# EAGLE design pc_healthypi_move_nRF5340_v4 (EAGLE 9.6.2)

## Sheet 1 of 2
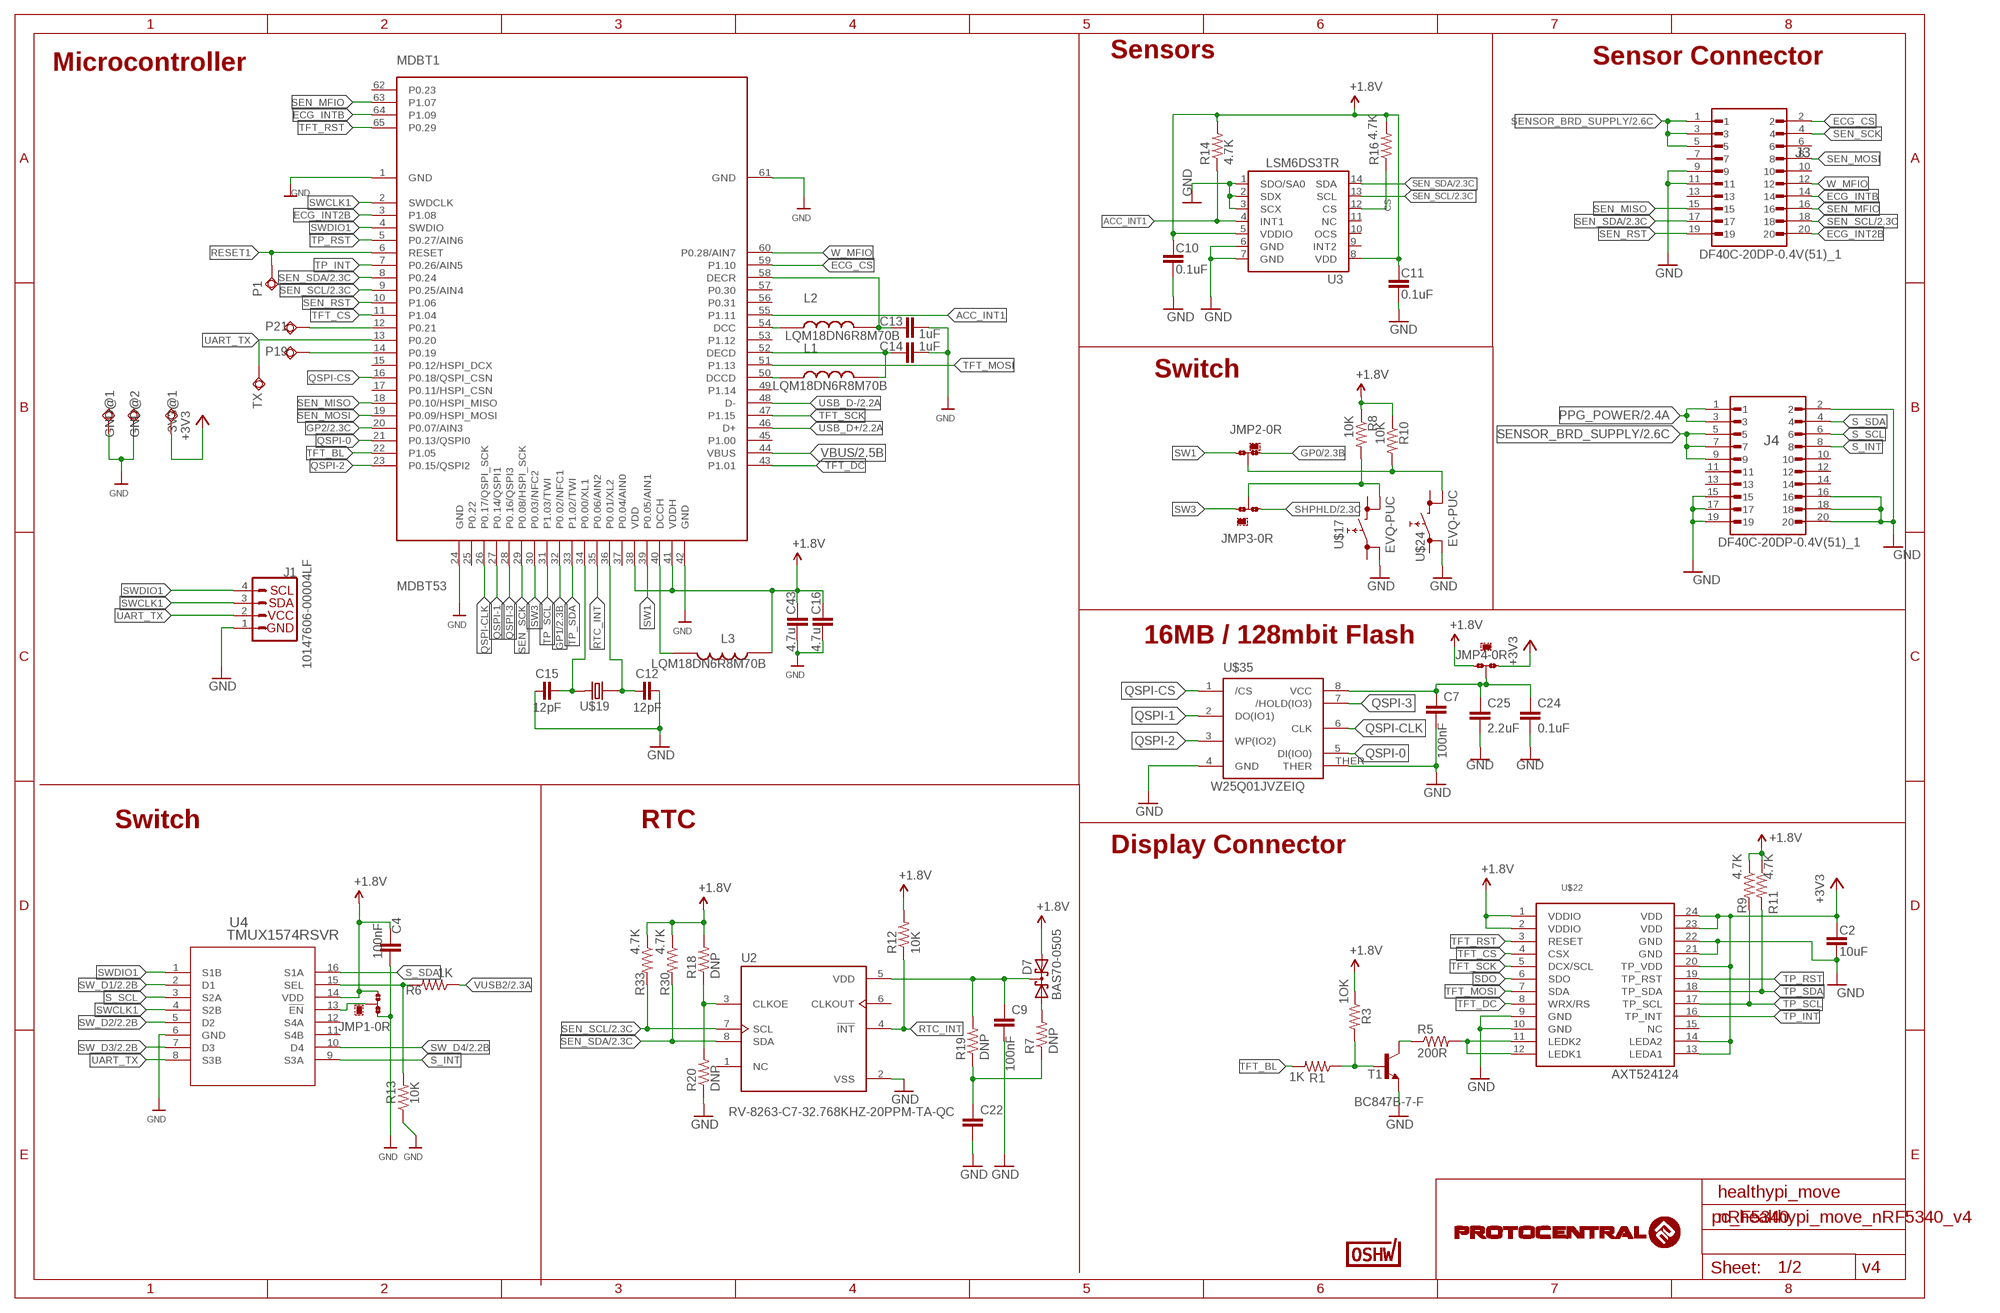
[diagram p0: schematic, sheet 1]

### Parts
3V3@1  TPSQTP13SQ  [TP13SQ]
C2  10uF  0.1UF-0603-100V-10%  [0603@1]
C4  100nF  2.2UF-0402_TIGHT-10V-10%-X5R  [0402-TIGHT]
C7  100nF  C-EUC0402  [C0402]
C9  100nF  C-EUC0402  [C0402]
C10  0.1uF  0.1UF-0402T-6.3V-10%-X7R  [0402-TIGHT]
C11  0.1uF  0.1UF-0402T-6.3V-10%-X7R  [0402-TIGHT]
C12  12pF  CAPACITORS-0402  [C0402]
C13  1uF  2.2UF-0402_TIGHT-10V-10%-X5R  [0402-TIGHT]
C14  1uF  2.2UF-0402_TIGHT-10V-10%-X5R  [0402-TIGHT]
C15  12pF  CAPACITORS-0402  [C0402]
C16  4.7u  C-EUC0402  [C0402]
C22  C-EUC1210  [C1210]
C24  0.1uF  0.1UF-0402T-6.3V-10%-X7R  [0402-TIGHT]
C25  2.2uF  2.2UF-0402_TIGHT-10V-10%-X5R  [0402-TIGHT]
C43  4.7u  C-EUC0402  [C0402]
D7  BAS70-0505  [SOT23]
GND@1  TPSQTP13SQ  [TP13SQ]
GND@2  TPSQTP13SQ  [TP13SQ]
J1  10147606-00004LF  QWIIC_CONNECTORJS-1MM  [JST04_1MM_RA]
J3  DF40C-20DP-0.4V(51)_1  [HRS_DF40C-20DP-0.4V(51)]
J4  DF40C-20DP-0.4V(51)_1  [HRS_DF40C-20DP-0.4V(51)]
JMP1  0R-JUMPB  [B0R-JMP]
JMP2  0R-JUMPB  [B0R-JMP]
JMP3  0R-JUMPB  [B0R-JMP]
JMP4  0R-JUMPB  [B0R-JMP]
L1  LQM18DN6R8M70B  [INDC1608X95N]
L2  LQM18DN6R8M70B  [INDC1608X95N]
L3  LQM18DN6R8M70B  [INDC1608X95N]
MDBT1  MDBT53  [MDBT53]
P1  TPSQTP13SQ  [TP13SQ]
P19  TPSQTP13SQ  [TP13SQ]
P21  TPSQTP13SQ  [TP13SQ]
R1  200  R-US_R0402  [R0402]
R3  200  R-US_R0402  [R0402]
R5  200R  R-US_R0402  [R0402]
R6  1K  RESISTOR0402-RES  [0402-RES]
R7  DNP  R-US_R0402  [R0402]
R8  10K  R-US_R0402  [R0402]
R9  4.7K  R-US_R0402  [R0402]
R10  10K  R-US_R0402  [R0402]
R11  4.7K  R-US_R0402  [R0402]
R12  10K  R-US_R0402  [R0402]
R13  10K  R-US_R0402  [R0402]
R14  4.7K  R-US_R0402  [R0402]
R16  4.7K  R-US_R0402  [R0402]
R18  DNP  R-US_R0402  [R0402]
R19  DNP  R-US_R0402  [R0402]
R20  DNP  R-US_R0402  [R0402]
R30  4.7K  R-US_R0402  [R0402]
R33  4.7K  R-US_R0402  [R0402]
T1  BC847B-7-F  MMBT2222ALT1-NPN-SOT23-BEC  [SOT23-BEC]
TX  TPSQTP13SQ  [TP13SQ]
U2  RV-8263-C7-32.768KHZ-20PPM-TA-QC  [IC_RV-8263-C7-32.768KHZ-20PPM-TA-QC]
U3  LSM6DS3TR  LSM6DS3  [LGA14L]
U4  TMUX1574RSVR  [RSV16_TEX]
U$1  CERT-SMALL  [CERT-SMALL-SILK]
U$17  EVQ-PUC  [EVQ-PUC]
U$19  520-327-12.5-34B(32.768KHZ)  ECS-X-34B  [ECX-31B]
U$22  AXT524124  [AXT524124]
U$24  EVQ-PUC  [EVQ-PUC]
U$35  W25Q01JVZEIQ  W25N01GVZEIG  [WSON-08]

### Nets
+1.8V: C4.1 C10.1 C11.1 C16.1 C43.1 D7.2(A2) JMP1.3 JMP4.3 L3.1 MDBT1.38(VDD) MDBT1.41(VDDH) R3.1 R8.1 R9.1 R10.1 R11.1 R12.2 R14.2 R16.2 R18.2 R30.1 R33.1 U3.5(VDDIO) U3.8(VDD) U4.14(VDD) U$22.1(VDDIO) U$22.2(VDDIO) ; also sheet 2
+3V3: 3V3@1.TP C2.1 JMP4.1 U$22.13(LEDA1) U$22.14(LEDA2) U$22.20(TP_VDD) U$22.23(VDD) U$22.24(VDD) ; also sheet 2
ACC_INT1: MDBT1.55(P1.11) R14.1 U3.4(INT1)
CS: R16.1 U3.12(CS)
ECG_CS: J3.2 MDBT1.59(P1.10)
ECG_INT2B: J3.20 MDBT1.3(P1.08)
ECG_INTB: J3.14 MDBT1.64(P1.09)
GND: C2.2 C4.2 C7.2 C9.2 C10.2 C11.2 C12.2 C13.2 C14.2 C15.1 C16.2 C22.2 C24.2 C25.2 C43.2 GND@1.TP GND@2.TP J1.1 J3.9 J3.11 J4.2 J4.15 J4.16 J4.17 J4.18 J4.19 J4.20 JMP1.1 MDBT1.1(GND) MDBT1.24(GND) MDBT1.42(GND) MDBT1.61(GND) R13.1 R20.1 T1.E U2.2(VSS) U3.1(SDO/SA0) U3.2(SDX) U3.3(SCX) U3.6(GND) U3.7(GND) U4.6(GND) U$17.3 U$22.9(GND) U$22.10(GND) U$22.21(GND) U$22.22(GND) U$24.3 U$35.4(GND) U$35.THER ; also sheet 2
GP0: JMP2.1 ; also sheet 2
GP1: MDBT1.32(P0.02/NFC1) ; also sheet 2
GP2: MDBT1.20(P0.07/AIN3) ; also sheet 2
N$5: MDBT1.12(P0.21) P21.TP
N$18: R5.2 U$22.11(LEDK2) U$22.12(LEDK1)
N$21: R5.1 T1.C
N$23: R1.1 R3.2 T1.B
N$26: R6.2 R13.2 U4.15(SEL)
N$28: C15.2 MDBT1.34(P0.00/XL1) U$19.P$2
N$30: C9.1 D7.3(K1K2) R19.2 U2.5(VDD)
N$31: R18.1 R20.2 U2.3(CLKOE)
N$32: D7.1(A1) R7.2
N$33: C22.1 R7.1 R19.1
N$34: C12.1 MDBT1.36(P0.01/XL2) U$19.P$1
N$36: L3.2 MDBT1.40(DCCH)
N$37: JMP1.2 U4.13(!EN)
N$38: L1.1 MDBT1.50(DCCD)
N$39: C14.1 L1.2 MDBT1.52(DECD)
N$40: L2.1 MDBT1.54(DCC)
N$41: C13.1 L2.2 MDBT1.58(DECR)
N$52: C7.1 C24.1 C25.1 JMP4.2 U$35.8(VCC)
P19: MDBT1.14(P0.19) P19.TP
PPG_POWER: J4.1 J4.3 ; also sheet 2
QSPI-0: MDBT1.21(P0.13/QSPI0) U$35.5(DI(IO0))
QSPI-1: MDBT1.27(P0.14/QSPI1) U$35.2(DO(IO1))
QSPI-2: MDBT1.23(P0.15/QSPI2) U$35.3(WP(IO2))
QSPI-3: MDBT1.28(P0.16/QSPI3) U$35.7(/HOLD(IO3))
QSPI-CLK [Clock]: MDBT1.26(P0.17/QSPI_SCK) U$35.6(CLK)
QSPI-CS: MDBT1.16(P0.18/QSPI_CSN) U$35.1(/CS)
RESET1: MDBT1.6(RESET) P1.TP
RTC_INT: MDBT1.35(P0.06/AIN2) R12.1 U2.4(!INT)
S_INT: J4.8 U4.9(S3A)
S_SCL: J4.6 U4.3(S2A)
S_SDA: J4.4 U4.16(S1A)
SDO: U$22.6(SDO)
SEN_MFIO: J3.16 MDBT1.63(P1.07)
SEN_MISO: J3.15 MDBT1.18(P0.10/HSPI_MISO)
SEN_MOSI: J3.8 MDBT1.19(P0.09/HSPI_MOSI)
SEN_RST: J3.19 MDBT1.10(P1.06)
SEN_SCK: J3.4 MDBT1.29(P0.08/HSPI_SCK)
SEN_SCL: J3.18 MDBT1.9(P0.25/AIN4) R33.2 U2.7(SCL) U3.13(SCL) ; also sheet 2
SEN_SDA: J3.17 MDBT1.8(P0.24) R30.2 U2.8(SDA) U3.14(SDA) ; also sheet 2
SENSOR_BRD_SUPPLY: J3.1 J3.3 J3.5 J4.5 J4.7 J4.9 ; also sheet 2
SHPHLD: JMP3.3 ; also sheet 2
SW1: JMP2.3 MDBT1.39(P0.05/AIN1)
SW3: JMP3.1 MDBT1.30(P0.03/NFC2)
SW11: JMP2.2 R10.2 U$24.2
SW33: JMP3.2 R8.2 U$17.2
SW_D1: U4.2(D1) ; also sheet 2
SW_D2: U4.5(D2) ; also sheet 2
SW_D3: U4.7(D3) ; also sheet 2
SW_D4: U4.10(D4) ; also sheet 2
SWCLK1: J1.3 MDBT1.2(SWDCLK) U4.4(S2B)
SWDIO1: J1.4 MDBT1.4(SWDIO) U4.1(S1B)
TFT_BL: MDBT1.22(P1.05) R1.2
TFT_CS: MDBT1.11(P1.04) U$22.4(CSX)
TFT_DC: MDBT1.43(P1.01) U$22.8(WRX/RS)
TFT_MOSI: MDBT1.51(P1.13) U$22.7(SDA)
TFT_RST: MDBT1.65(P0.29) U$22.3(RESET)
TFT_SCK: MDBT1.47(P1.15) U$22.5(DCX/SCL)
TP_INT: MDBT1.7(P0.26/AIN5) U$22.16(TP_INT)
TP_RST: MDBT1.5(P0.27/AIN6) U$22.19(TP_RST)
TP_SCL: MDBT1.31(P1.03/TWI) R9.2 U$22.17(TP_SCL)
TP_SDA: MDBT1.33(P1.02/TWI) R11.2 U$22.18(TP_SDA)
UART_TX: J1.2 MDBT1.13(P0.20) TX.TP U4.8(S3B)
USB_D+: MDBT1.46(D+) ; also sheet 2
USB_D-: MDBT1.48(D-) ; also sheet 2
VBUS: MDBT1.44(VBUS) ; also sheet 2
VUSB2: R6.1 ; also sheet 2
W_MFIO: J3.12 MDBT1.60(P0.28/AIN7)
Unconnected: J3.6 J3.7 J3.10 J3.13 J4.10 J4.11 J4.12 J4.13 J4.14 MDBT1.15(P0.12/HSPI_DCX) MDBT1.17(P0.11/HSPI_CSN) MDBT1.25(P0.22) MDBT1.37(P0.04/AIN0) MDBT1.45(P1.00) MDBT1.49(P1.14) MDBT1.53(P1.12) MDBT1.56(P0.31) MDBT1.57(P0.30) MDBT1.62(P0.23) U2.1(NC) U2.6(CLKOUT) U3.9(INT2) U3.10(OCS) U3.11(NC) U4.11(S4B) U4.12(S4A) U$17.1 U$17.4 U$22.15(NC) U$24.1 U$24.4

### Notes on the sheet
- Sensors | Sensor Connector
- Microcontroller
- Switch
- 16MB / 128mbit Flash
- Switch | RTC
- Display Connector
- 1OK
- 1K
- healthypi_move
- nRF5340
- v4

## Sheet 2 of 2
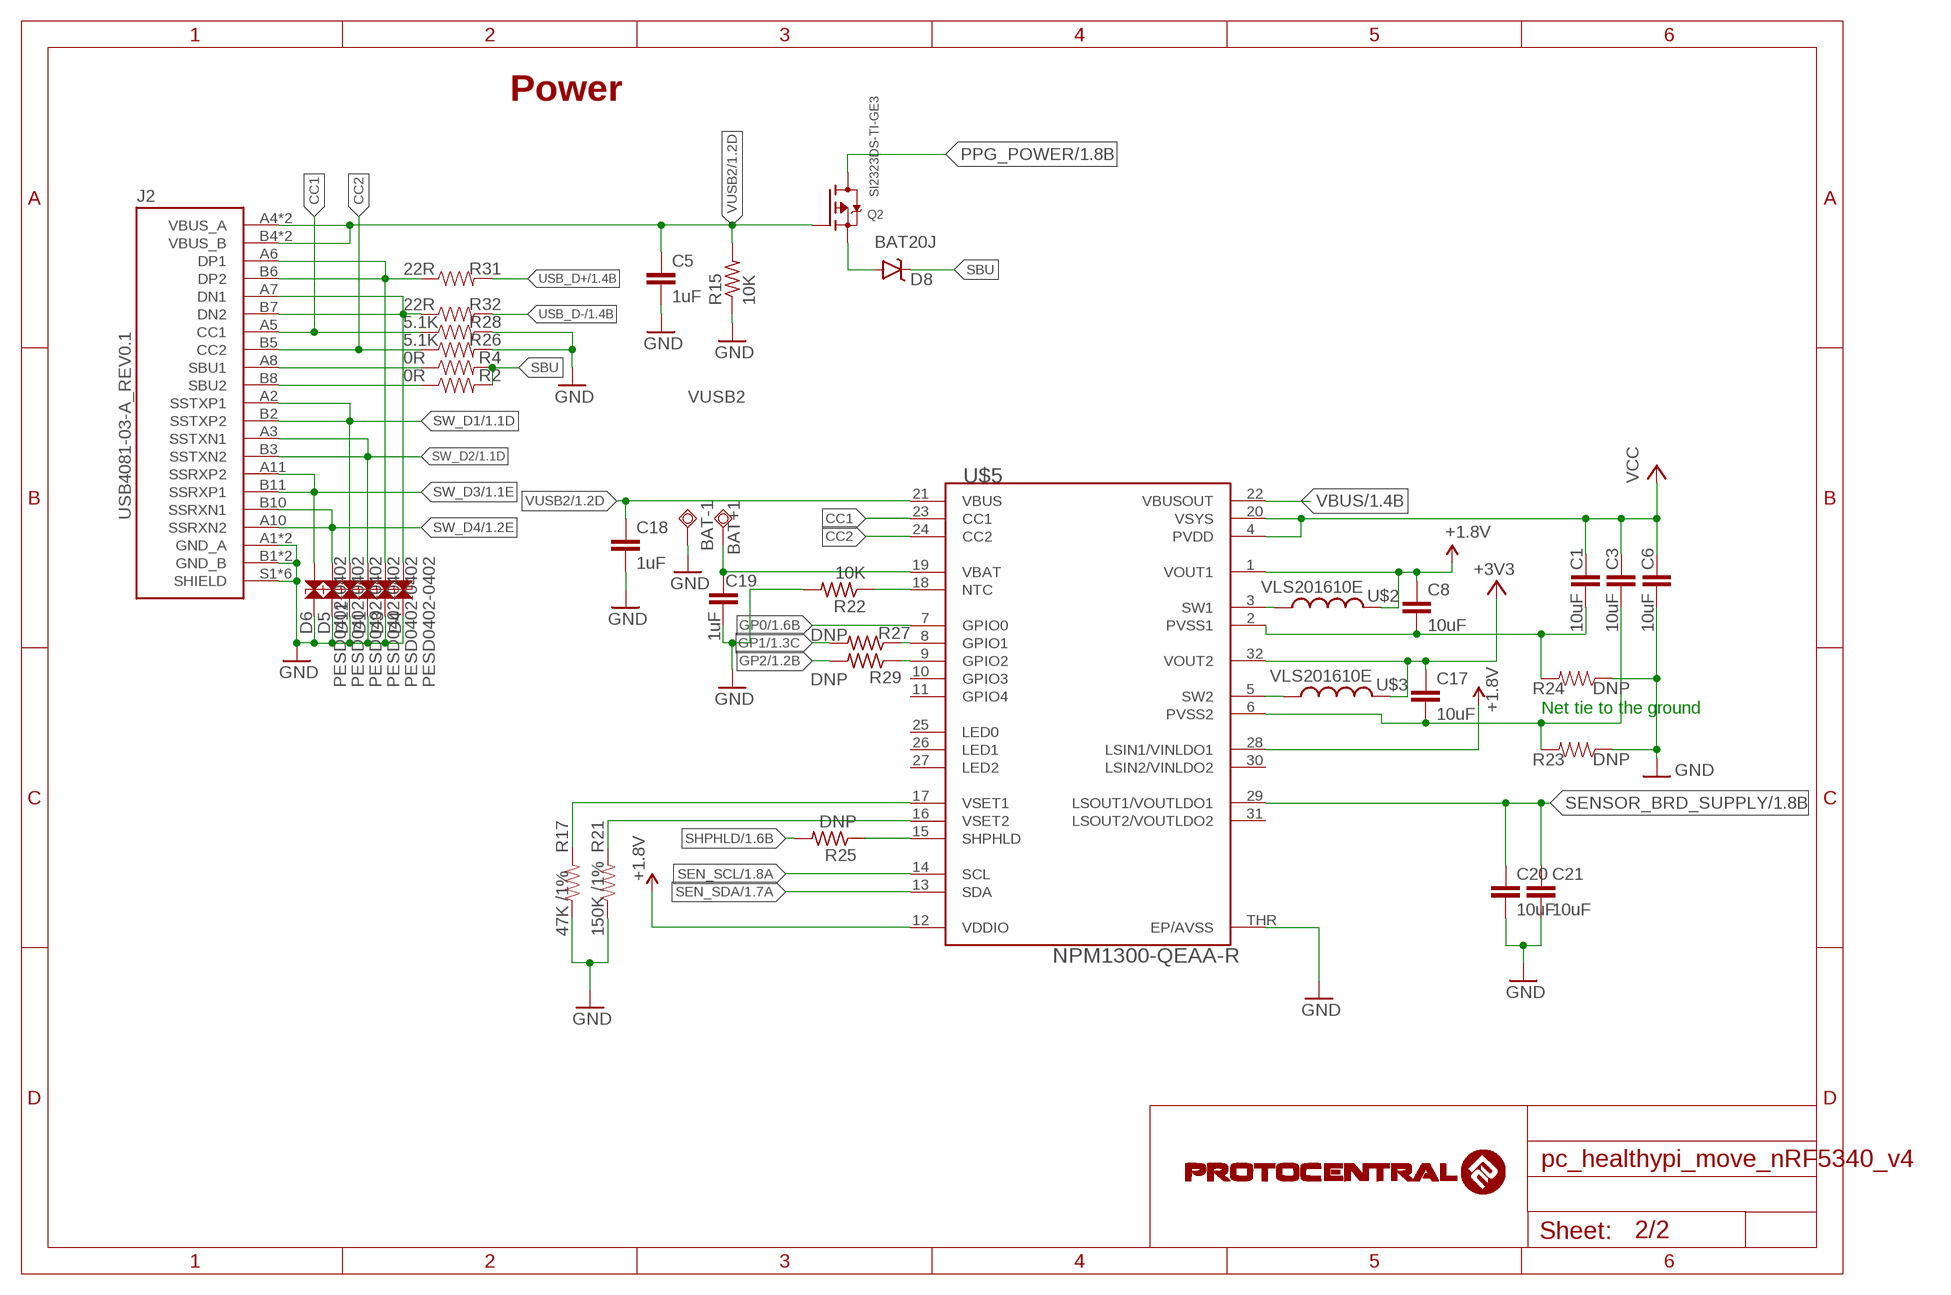
[diagram p1: schematic, sheet 2]

### Parts
BAT+1  TPSQTP13SQ  [TP13SQ]
BAT-1  TPSQTP13SQ  [TP13SQ]
C1  10uF  2.2UF-0402_TIGHT-10V-10%-X5R  [0402-TIGHT]
C3  10uF  2.2UF-0402_TIGHT-10V-10%-X5R  [0402-TIGHT]
C5  1uF  2.2UF-0402_TIGHT-10V-10%-X5R  [0402-TIGHT]
C6  10uF  2.2UF-0402_TIGHT-10V-10%-X5R  [0402-TIGHT]
C8  10uF  2.2UF-0402_TIGHT-10V-10%-X5R  [0402-TIGHT]
C17  10uF  2.2UF-0402_TIGHT-10V-10%-X5R  [0402-TIGHT]
C18  1uF  2.2UF-0402_TIGHT-10V-10%-X5R  [0402-TIGHT]
C19  1uF  2.2UF-0402_TIGHT-10V-10%-X5R  [0402-TIGHT]
C20  10uF  2.2UF-0402_TIGHT-10V-10%-X5R  [0402-TIGHT]
C21  10uF  2.2UF-0402_TIGHT-10V-10%-X5R  [0402-TIGHT]
D1  PESD0402-0402  [0402]
D3  PESD0402-0402  [0402]
D4  PESD0402-0402  [0402]
D5  PESD0402-0402  [0402]
D6  PESD0402-0402  [0402]
D8  BAT20J  DIODE-SCHOTTKY-BAT20J  [SOD-323]
D11  PESD0402-0402  [0402]
J2  USB4081-03-A_REV0.1  [GCT_USB4081-03-A_REV0.1]
Q2  SI2323DS-TI-GE3  MOSFET-P  [SOT23-R]
R2  0R  RESISTOR0402-RES  [0402-RES]
R4  0R  RESISTOR0402-RES  [0402-RES]
R15  10K  R-US_R0402  [R0402]
R17  47K /1%  RESISTOR0402-RES  [0402-RES]
R21  150K /1%  RESISTOR0402-RES  [0402-RES]
R22  10K  R-US_R0402  [R0402]
R23  DNP  RESISTOR0402-RES  [0402-RES]
R24  DNP  RESISTOR0402-RES  [0402-RES]
R25  DNP  R-US_R0402  [R0402]
R26  5.1K  RESISTOR0402-RES  [0402-RES]
R27  DNP  R-US_R0402  [R0402]
R28  5.1K  RESISTOR0402-RES  [0402-RES]
R29  DNP  R-US_R0402  [R0402]
R31  22R  RESISTOR0402-RES  [0402-RES]
R32  22R  RESISTOR0402-RES  [0402-RES]
U$2  VLS201610E  [VLS201610E]
U$3  VLS201610E  [VLS201610E]
U$5  NPM1300-QEAA-R  [PWQFN-32]

### Nets
+1.8V: C8.1 U$2.2 U$5.1(VOUT1) U$5.12(VDDIO) U$5.28(LSIN1/VINLDO1) ; also sheet 1
+3V3: C17.1 U$3.2 U$5.32(VOUT2) ; also sheet 1
CC1: J2.A5(CC1) R28.1 U$5.23(CC1)
CC2: J2.B5(CC2) R26.1 U$5.24(CC2)
GND: BAT-1.TP C5.2 C6.2 C18.2 C19.2 C20.2 C21.2 D1.1 D3.1 D4.1 D5.1 D6.1 D11.1 J2.A1(GND_A) J2.A12(GND_A) J2.B1(GND_B) J2.B12(GND_B) J2.S1(SHIELD) J2.S2(SHIELD) J2.S3(SHIELD) J2.S4(SHIELD) J2.S5(SHIELD) J2.S6(SHIELD) R15.1 R17.1 R21.1 R22.2 R23.1 R24.1 R26.2 R28.2 U$5.THR(EP/AVSS) ; also sheet 1
GP0: U$5.7(GPIO0) ; also sheet 1
GP1: R27.2 ; also sheet 1
GP2: R29.2 ; also sheet 1
N$1: J2.B8(SBU2) R2.1
N$2: J2.A8(SBU1) R4.1
N$3: R17.2 U$5.17(VSET1)
N$4: R21.2 U$5.16(VSET2)
N$6: R27.1 U$5.8(GPIO1)
N$7: C3.2 C17.2 R23.2 U$5.6(PVSS2)
N$8: D3.2 J2.A6(DP1) J2.B6(DP2) R31.1
N$9: D4.2 J2.A7(DN1) J2.B7(DN2) R32.1
N$25: U$3.1 U$5.5(SW2)
N$42: U$2.1 U$5.3(SW1)
N$43: D8.A Q2.2(S)
N$44: BAT+1.TP C19.1 U$5.19(VBAT)
N$45: R29.1 U$5.9(GPIO2)
N$46: C1.2 C8.2 R24.2 U$5.2(PVSS1)
N$50: R22.1 U$5.18(NTC)
N$51: R25.1 U$5.15(SHPHLD)
PPG_POWER: Q2.3(D) ; also sheet 1
SBU: D8.C R2.2 R4.2
SEN_SCL: U$5.14(SCL) ; also sheet 1
SEN_SDA: U$5.13(SDA) ; also sheet 1
SENSOR_BRD_SUPPLY: C20.1 C21.1 U$5.29(LSOUT1/VOUTLDO1) ; also sheet 1
SHPHLD: R25.2 ; also sheet 1
SW_D1: D11.2 J2.A2(SSTXP1) J2.B2(SSTXP2) ; also sheet 1
SW_D2: D1.2 J2.A3(SSTXN1) J2.B3(SSTXN2) ; also sheet 1
SW_D3: D6.2 J2.A11(SSRXP2) J2.B11(SSRXP1) ; also sheet 1
SW_D4: D5.2 J2.A10(SSRXN2) J2.B10(SSRXN1) ; also sheet 1
USB_D+: R31.2 ; also sheet 1
USB_D-: R32.2 ; also sheet 1
VBUS: U$5.22(VBUSOUT) ; also sheet 1
VCC: C1.1 C3.1 C6.1 U$5.4(PVDD) U$5.20(VSYS)
VUSB2: C5.1 C18.1 J2.A4(VBUS_A) J2.A9(VBUS_A) J2.B4(VBUS_B) J2.B9(VBUS_B) Q2.1(G) R15.2 U$5.21(VBUS) ; also sheet 1
Unconnected: U$5.10(GPIO3) U$5.11(GPIO4) U$5.25(LED0) U$5.26(LED1) U$5.27(LED2) U$5.30(LSIN2/VINLDO2) U$5.31(LSOUT2/VOUTLDO2)

### Notes on the sheet
- Power
- Net tie to the ground

## Library data of the parts
3V3@1 BAT+1 BAT-1 GND@1 GND@2 P1 P19 P21 TX = testpad:TPSQ: Test pad
C1 C3-C6 C8 C13 C14 C17-C21 = SparkFun-Capacitors:2.2UF: 2.2µF ceramic capacitors A capacitor is a passive two-terminal electrical component used to store electrical energy temporarily in an electric field.; PROD_ID: CAP-14232; VALUE: 2.2uF
C2 = SparkFun-Capacitors:0.1UF: 0.1µF ceramic capacitors A capacitor is a passive two-terminal electrical component used to store electrical energy temporarily in an electric field.; PROD_ID: CAP-08390; VALUE: 0.1uF
C7 C9 C16 C22 C43 = rcl:C-EU: CAPACITOR, European symbol; SPICEPREFIX: C
C10 C11 C24 = SparkFun-Capacitors:0.1UF: 0.1µF ceramic capacitors A capacitor is a passive two-terminal electrical component used to store electrical energy temporarily in an electric field.; PROD_ID: CAP-14993
C12 C15 = Arduino:CAPACITORS: Capacitors ...4.7uF @ 6.3V -> 0402 ...10uF @ 16V -> 0603 ...22uF @ 25V -> 0805
C25 = SparkFun-Capacitors:2.2UF: 2.2µF ceramic capacitors A capacitor is a passive two-terminal electrical component used to store electrical energy temporarily in an electric field.; PROD_ID: CAP-14232
D1 D3-D6 D11 = SparkFun-DiscreteSemi:PESD0402: ESD protection diode PESD is used to protect a signal line from ESD.; DIGIKEY_PART: PESD0402-140CT-ND; MOUSE_PART: 650-PESD0402-140; PROD_ID: DIO-15359
D7 = circuitects:BAS70-05: General-purpose Schottky diodes General-purpose Schottky diodes in small Surface-Mounted Device (SMD) plastic packages AAL Eindhoven MK Check availability <https://pricing.snapeda.com/parts/BAS70-05/Diotec/view-part?ref=eda>; AVAILABILITY: In Stock; CHECK_PRICES: https://www.snapeda.com/parts/BAS70-05/Diotec/view-part/?ref=eda; DESCRIPTION: Schottky, SOT-23, 70V, 0.07A, 150C; MF: Diotec; MP: BAS70-05; PACKAGE: SOT-23-3 Diotec; PRICE: None; SNAPEDA_LINK: https://www.snapeda.com/parts/BAS70-05/Diotec/view-part/?ref=snap
D8 = SparkFun-DiscreteSemi:DIODE-SCHOTTKY: Schottky diodes in SFE's production catalog BAT20J 1A 23V 0.62Vf RB751 120mA 40V 0.37Vf PMEG4005EJ 0.5A 40V 0.42Vf MBRA140 1A 40V 0.5Vf B340A 3A 40V SMA; PROD_ID: DIO-11623
J1 = SparkFun-Connectors:QWIIC_CONNECTOR: SparkFun I2C Standard Qwiic Connector An SMD 1mm pitch JST connector makes it easy and quick (get it? Qwiic?) to connect I2C devices to each other. The Qwiic system <http://www.sparkfun.com/qwiic> enables fast and solderless connection between popular platforms and various sensors and actuators. We carry 200mm <https://www.sparkfun.com/products/14204>, 100mm <https://www.sparkfun.com/products/14205>, 50mm <https://www.sparkfun.com/products/14206>, and breadboard friendly <https://www.sparkfun.com/products/14207> Qwiic cables. We also offer 10 pcs strips <https://www.sparkfun.com/products/14323> the SMD connectors.; PROD_ID: CONN-13694; VALUE: QWIIC_RIGHT_ANGLE
J2 = circuitects:USB4081-03-A_REV0.1: Check availability <https://pricing.snapeda.com/parts/USB4081-03-A/Global%20Connector%20Technology/view-part?ref=eda>; AVAILABILITY: In Stock; DESCRIPTION: Type C USB 3.2 Gen 2 Connector; MF: Global Connector Technology; MP: USB4081-03-A; PACKAGE: None; PRICE: None
J3 J4 = circuitects:DF40C-20DP-0.4V(51)_1; MANUFACTURER: Hirose Electric; MAXIMUM_PACKAGE_HEIGHT: 1.29mm; PARTREV: 02/2020; STANDARD: Manufacturer Recommendations
JMP1-JMP4 = jump-0r-smd:0R-JUMP: SMD 0R 0805 Jumper
L1-L3 = circuitects:LQM18DN6R8M70B: Inductor with Inductance 6.8uH Tol.+/-20% Package 0603 (1608) Check availability <https://pricing.snapeda.com/parts/LQM18DN6R8M70B/Murata/view-part?ref=eda>; AVAILABILITY: In Stock; CHECK_PRICES: https://www.snapeda.com/parts/LQM18DN6R8M70B/Murata/view-part/?ref=eda; DESCRIPTION: Inductor with Inductance 6.8uH Tol.+/-20% Package 0603 (1608); MF: Murata; MP: LQM18DN6R8M70B; PACKAGE: 0603 Murata; PRICE: None; SNAPEDA_LINK: https://www.snapeda.com/parts/LQM18DN6R8M70B/Murata/view-part/?ref=snap
MDBT1 = circuitects:MDBT53: Raytac Corporation Part Number: MDBT53-1M / MDBT53-P1M / MDBT53-U1M Bluetooth Low Energy Module based on Noridc nRF5340 Size: 14.3x9.3mm Source: Raytac datasheet
Q2 = microbuilder:MOSFET-P: P-Channel Mosfet SOT-23 IRLML5103 30V 760mA 1V Vgs - Digikey: IRLML5103PBFCT-ND NTR0202PL 20V 400mA 2.3V Vgs - Digikey: NTR0202PLT1GOSTR-ND NTR4101PT1G 20V 1.8A 1.2V Vgs - Digikey: NTR4101PT1GOSCT-ND DMP2004K 20V 600mA 1V Vgs - Digikey: DMP2004KDICT-ND
R1 R3 R5 R7-R16 R18-R20 R22 R25 R27 R29 R30 R33 = rcl:R-US_: RESISTOR, American symbol; SPICEPREFIX: R
R2 R4 R6 R17 R21 R23 R24 R26 R28 R31 R32 = SparkFun:RESISTOR: Resistor Basic schematic elements and footprints for 0603, 1206, and PTH resistors.
T1 = transistor:*-NPN-: NPN Transistror BF959 corrected 2008.03.06
U2 = circuitects:RV-8263-C7-32.768KHZ-20PPM-TA-QC: Check availability <https://pricing.snapeda.com/parts/RV-8263-C7-32.768KHZ-20PPM-TA-QC/Micro%20Crystal/view-part?ref=eda>; AVAILABILITY: In Stock; CHECK_PRICES: https://www.snapeda.com/parts/RV-8263-C7-32.768KHZ-20PPM-TA-QC/Micro+Crystal/view-part/?ref=eda; DESCRIPTION: Real-Time Clock Module in 1.5 x 3.2 mm package; MF: Micro Crystal; MP: RV-8263-C7-32.768KHZ-20PPM-TA-QC; PACKAGE: QFN-8 Micro Crystal; PRICE: None; SNAPEDA_LINK: https://www.snapeda.com/parts/RV-8263-C7-32.768KHZ-20PPM-TA-QC/Micro+Crystal/view-part/?ref=snap
U3 = LSM6DS3:LSM6DS3
U4 = circuitects:TMUX1574RSVR; COPYRIGHT: Copyright (C) 2024 Ultra Librarian. All rights reserved.; MANUFACTURER_PART_NUMBER: TMUX1574RSVR; MFR_NAME: Texas Instruments
U$1 = OSHWA:CERT
U$2 U$3 = circuitects:VLS201610E
U$5 = circuitects:NPM1300-QEAA-R
U$17 U$24 = circuitects:EVQ-PUC
U$19 = circuitects:ECS-X-34B
U$22 = circuitects:AXT524124: Panasonic AXT524124 connector for LI-LBCM3M1 3MP camera module
U$35 = circuitects:W25N01GVZEIG

## Net classes
2 Clock: width 0.089 mm, clearance 0.178 mm

## Board
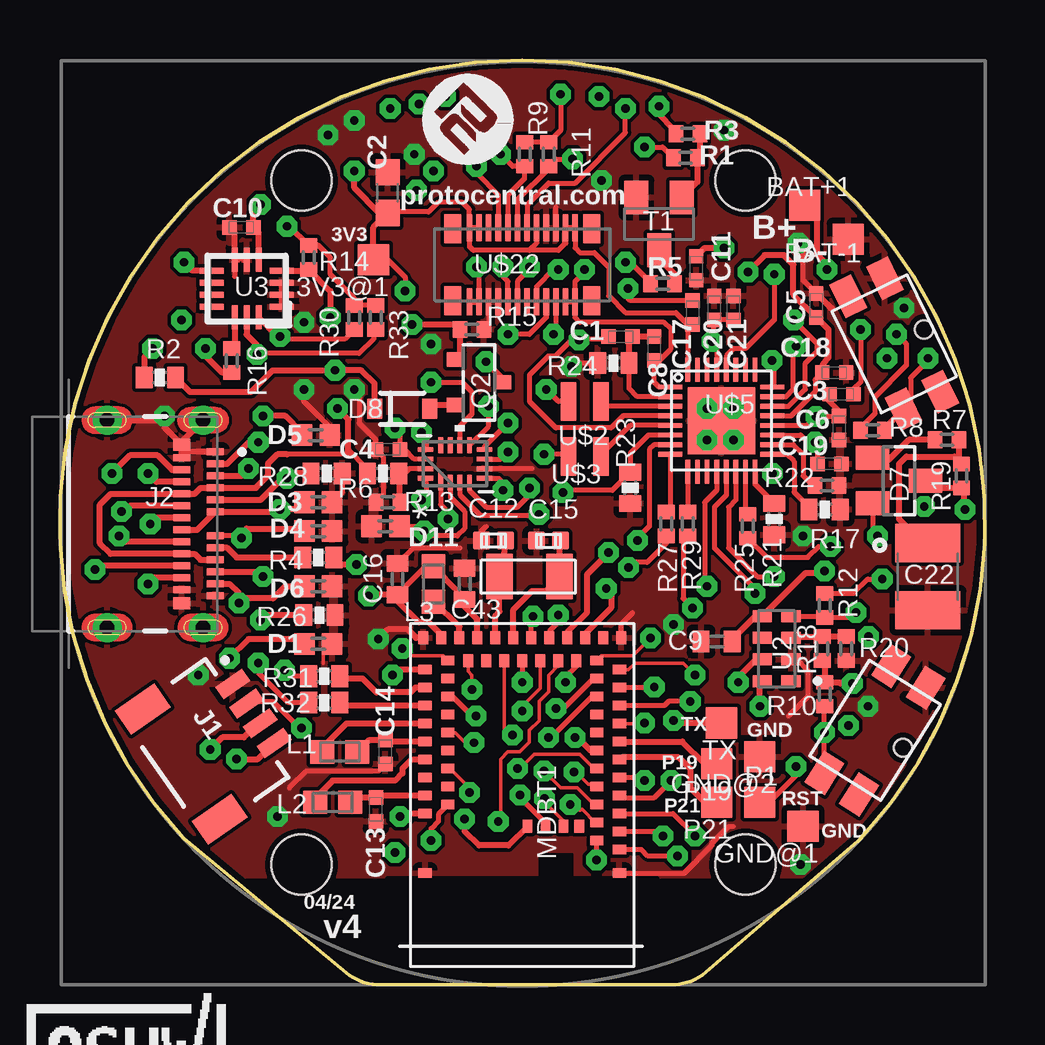
[diagram p2: board, top side]
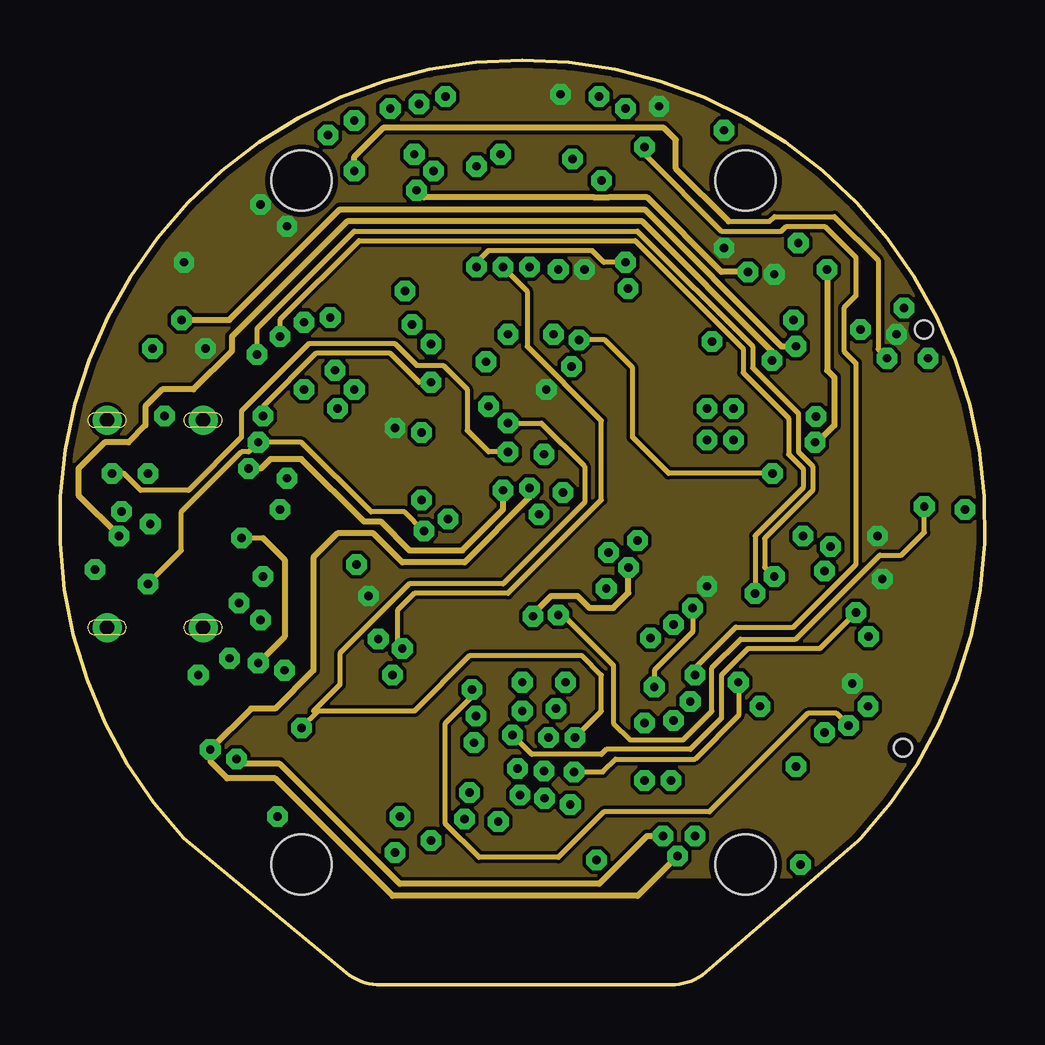
[diagram p3: board, inner layer Route2]
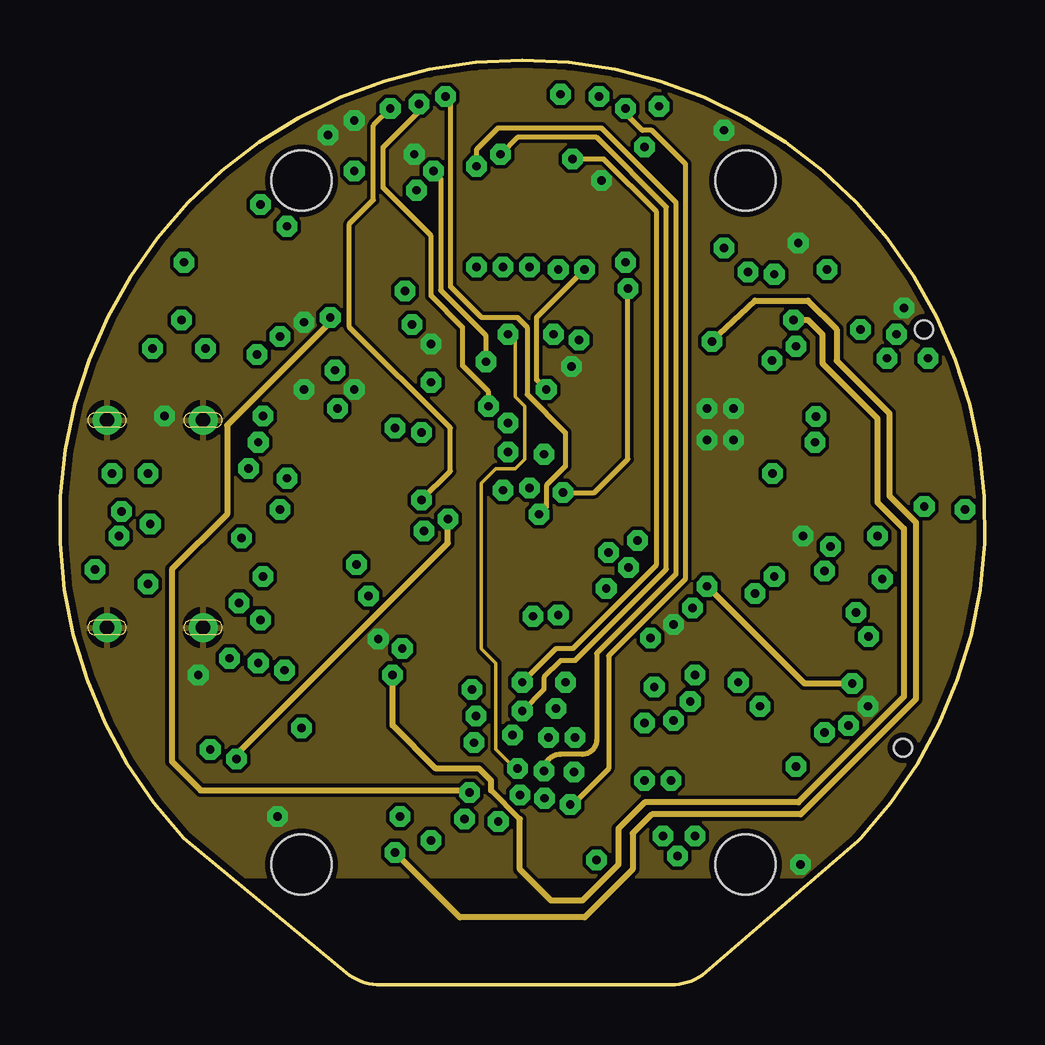
[diagram p4: board, inner layer Route15]
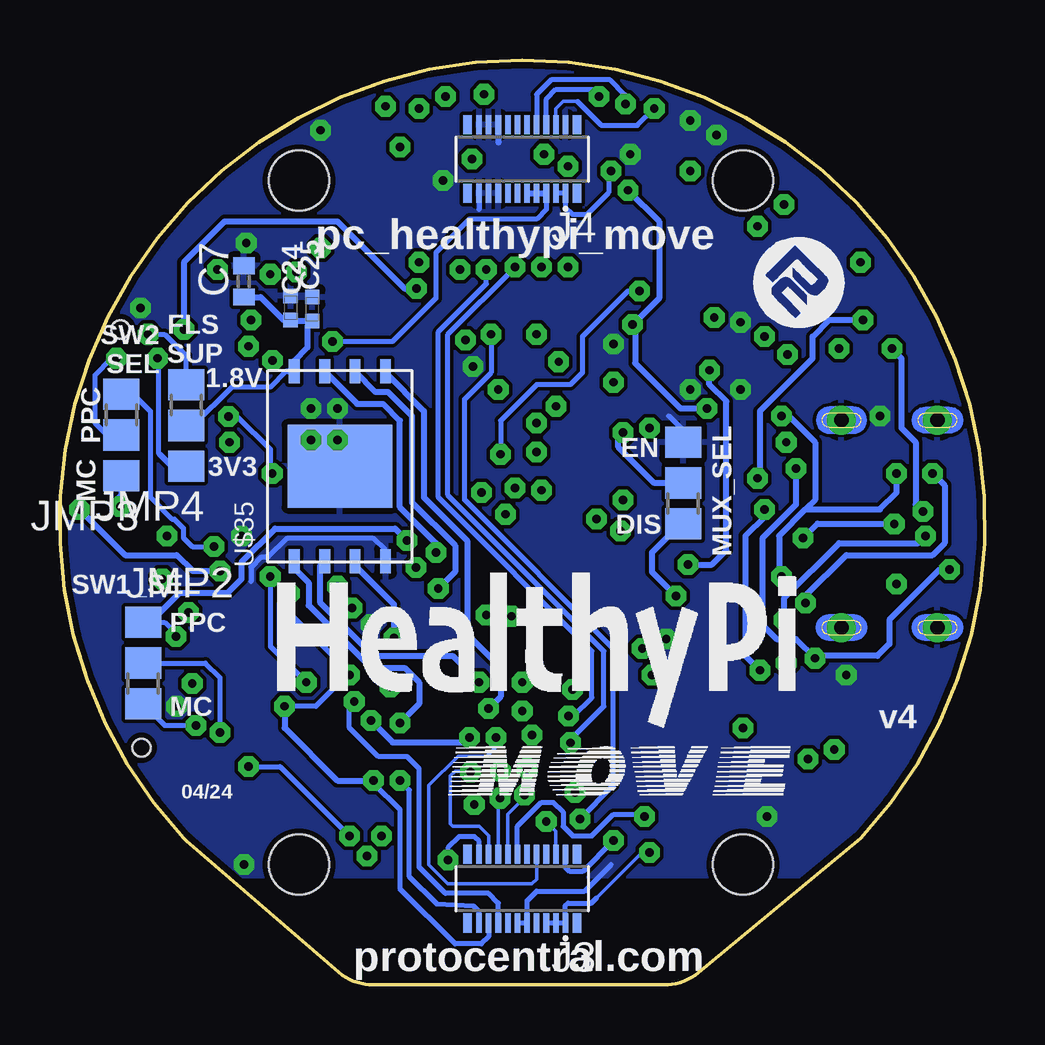
[diagram p5: board, bottom side, seen from below]

Size 38.52 x 38.54 mm. Coordinates in mm from the lower left corner, seen from the top.
Outline: 13.56,0.01 25.46,0.01 arc37 26.76,0.41 33.26,6.01 33.36,6.11 arc266 5.16,6.11 12.06,0.41 arc42 13.56,0.01
Copper layers (1*2*15*16): Top 0.035mm / dielectric 0.26mm / Route2 0.035mm / dielectric 0.2mm / Route15 0.035mm / dielectric 0.2mm / Bottom 0.035mm
Design rules "Circuitects-Rules *": minimum track width 6mil, minimum drill 0.3mm, track to track 6mil, track to pad 6mil, pad to pad 6mil, via to via 6mil, smd to smd 6mil, copper to edge 10mil, drill to drill 8mil, minimum pad ring 12mil, minimum via ring 10mil, stop-mask expansion 4mil, vias tented up to drill 25mil, thermal gap 10mil
Holes 2.5 mm at 10.06,33.51 28.56,33.51 10.06,5.01 28.56,5.01

### Footprints (pad centres in the part's own frame; a part is rotated, then mirrored left to right if it is on the bottom)
TP13SQ = smd 1.3 x 1.3: TP 0,0
0402-TIGHT = smd 0.6 x 0.6: 1 -0.5,0; 2 0.5,0
0603@1 = smd 1.1 x 1: 1 -0.85,0; 2 0.85,0
C0402 = smd 0.7 x 0.9: 1 -0.65,0; 2 0.65,0
C0402' = smd 0.75 x 0.7: 1 0,0.5; 2 0,-0.5
C1210 = smd 1.6 x 2.7: 1 -1.4,0; 2 1.4,0
0402 = smd 0.85 x 0.9: 1 -0.58,0; 2 0.58,0
SOT23 = smd 1 x 1.4: 1 -0.95,-1.1; 2 0.95,-1.1; 3 0,1.1
SOD-323 = smd 0.63 x 0.83: A 1.15,0; C -1.15,0
JST04_1MM_RA = smd 0.6 x 1.35: 1 -1.5,0; 2 -0.5,0; 3 0.5,0; 4 1.5,0 | smd 1.2 x 2: NC1 2.8,-3.675; NC2 -2.8,-3.675
GCT_USB4081-03-A_REV0.1 = smd 0.3 x 0.7: A1 -3,0.51; A2 -2.5,0.51; A3 -2,0.51; A4 -1.5,0.51; A5 -1,0.51; A6 -0.5,0.51; A7 0.5,0.51; A8 1,0.51; A9 1.5,0.51; A10 2,0.51; A11 2.5,0.51; A12 3,0.51; B1 2.75,-0.89; B2 2.25,-0.89; B3 1.75,-0.89; B4 1.25,-0.89; B5 0.75,-0.89; B6 0.25,-0.89; B7 -0.25,-0.89; B8 -0.75,-0.89; B9 -1.25,-0.89; B10 -1.75,-0.89; B11 -2.25,-0.89; B12 -2.75,-0.89 | drill 0.6 pad 1.1: S1 -4.32,-4; S2 4.32,-4; S3 -4.32,0; S4 4.32,0 | smd 0.5 x 0.7: S5 -3.3,-0.89; S6 3.3,-0.89
HRS_DF40C-20DP-0.4V(51) = smd 0.23 x 0.8: 1 -1.8,1.43; 2 -1.8,-1.43; 3 -1.4,1.43; 4 -1.4,-1.43; 5 -1,1.43; 6 -1,-1.43; 7 -0.6,1.43; 8 -0.6,-1.43; 9 -0.2,1.43; 10 -0.2,-1.43; 11 0.2,1.43; 12 0.2,-1.43; 13 0.6,1.43; 14 0.6,-1.43; 15 1,1.43; 16 1,-1.43; 17 1.4,1.43; 18 1.4,-1.43; 19 1.8,1.43; 20 1.8,-1.43 | smd 0.35 x 0.8: S1 -2.275,1.43; S2 -2.275,-1.43; S3 2.275,1.43; S4 2.275,-1.43
B0R-JMP = smd 1.5 x 1.3: 1 0,1.7; 2 0,0; 3 0,-1.7
INDC1608X95N = smd 1 x 0.97: 1 -0.735,0; 2 0.735,0
MDBT53 = smd 0.55 x 0.4: 1 -4.05,3.25; 2 -4.05,2.275; 3 -3.1,1.9; 4 -4.05,1.525; 5 -3.1,1.15; 6 -4.05,0.775; 7 -3.1,0.4; 8 -4.05,0.025; 9 -3.1,-0.35; 10 -4.05,-0.725; 11 -3.1,-1.1; 12 -4.05,-1.475; 13 -3.1,-1.85; 14 -4.05,-2.225; 15 -3.1,-2.6; 16 -4.05,-2.975; 17 -3.1,-3.35; 18 -4.05,-3.725; 19 -3.1,-4.1; 20 -4.05,-4.475; 21 -3.1,-4.85; 22 -4.05,-5.225; 23 -3.1,-5.6; 43 3.1,-5.6; 44 4.05,-5.225; 45 3.1,-4.85; 46 4.05,-4.475; 47 3.1,-4.1; 48 4.05,-3.725; 49 3.1,-3.35; 50 4.05,-2.975; 51 3.1,-2.6; 52 4.05,-2.225; 53 3.1,-1.85; 54 4.05,-1.475; 55 3.1,-1.1; 56 4.05,-0.725; 57 3.1,-0.35; 58 4.05,0.025; 59 3.1,0.4; 60 4.05,0.775; 61 4.05,3.25 | smd 0.4 x 0.55: 24 -4.125,-6.55; 25 -3.375,-6.55; 26 -2.625,-6.55; 27 -2.25,-5.6; 28 -1.875,-6.55; 29 -1.5,-5.6; 30 -1.125,-6.55; 31 -0.75,-5.6; 32 -0.375,-6.55; 33 0,-5.6; 34 0.375,-6.55; 35 0.75,-5.6; 36 1.125,-6.55; 37 1.5,-5.6; 38 1.875,-6.55; 39 2.25,-5.6; 40 2.625,-6.55; 41 3.375,-6.55; 42 4.125,-6.55; 62 -2.375,1.3; 63 -1.725,1.3; 64 -0.975,1.3; 65 -0.225,1.3
SOT23-R = smd 0.6 x 0.7: 1 -0.95,-1; 2 0.95,-1; 3 0,1
R0402 = smd 0.6 x 0.7: 1 -0.5,0; 2 0.5,0
0402-RES = smd 0.7 x 0.9: 1 -0.65,0; 2 0.65,0
SOT23-BEC = smd 1 x 1.4: B -0.95,-1.1; C 0,1.1; E 0.95,-1.1
IC_RV-8263-C7-32.768KHZ-20PPM-TA-QC = smd 0.8 x 0.5: 1 -0.6,1.35; 2 -0.6,0.45; 3 -0.6,-0.45; 4 -0.6,-1.35; 5 0.6,-1.35; 6 0.6,-0.45; 7 0.6,0.45; 8 0.6,1.35
LGA14L = smd 1 x 0.25: 1 -1.45,0.75; 2 -1.45,0.25; 3 -1.45,-0.25; 4 -1.45,-0.75; 8 1.45,-0.75; 9 1.45,-0.25; 10 1.45,0.25; 11 1.45,0.75 | smd 0.25 x 1: 5 -0.5,-1.2; 6 0,-1.2; 7 0.5,-1.2; 12 0.5,1.2; 13 0,1.2; 14 -0.5,1.2
RSV16_TEX = smd 0.75 x 0.2: 1 -0.724,0.6 | smd 0.65 x 0.2: 2 -0.775,0.2; 3 -0.775,-0.2; 4 -0.775,-0.6; 9 0.775,-0.6; 10 0.775,-0.2; 11 0.775,0.2; 12 0.775,0.6 | smd 0.2 x 0.65: 5 -0.6,-1.23; 6 -0.2,-1.23; 7 0.2,-1.23; 8 0.6,-1.23; 13 0.6,1.23; 14 0.2,1.23; 15 -0.2,1.23; 16 -0.6,1.23
VLS201610E = smd 0.65 x 1.6: 1 -0.675,0; 2 0.675,0
PWQFN-32 = smd 1 x 0.2: 1 -2.125,1.4; 2 -2.125,1; 3 -2.125,0.6; 4 -2.125,0.2; 5 -2.125,-0.2; 6 -2.125,-0.6; 7 -2.125,-1; 8 -2.125,-1.4; 17 2.125,-1.4; 18 2.125,-1; 19 2.125,-0.6; 20 2.125,-0.2; 21 2.125,0.2; 22 2.125,0.6; 23 2.125,1; 24 2.125,1.4 | smd 0.2 x 1: 9 -1.4,-2.125; 10 -1,-2.125; 11 -0.6,-2.125; 12 -0.2,-2.125; 13 0.2,-2.125; 14 0.6,-2.125; 15 1,-2.125; 16 1.4,-2.125; 25 1.4,2.125; 26 1,2.125; 27 0.6,2.125; 28 0.2,2.125; 29 -0.2,2.125; 30 -0.6,2.125; 31 -1,2.125; 32 -1.4,2.125 | smd 2.8 x 2.8: THR 0,0
EVQ-PUC = smd 1.55 x 1: 1 2.625,0.85; 2 2.625,-0.85; 3 -2.625,0.85; 4 -2.625,-0.85 | hole 0.75: 0,1.375
ECX-31B = smd 1.1 x 1.9: P$1 1.25,0; P$2 -1.25,0
AXT524124 = smd 0.23 x 1.12: 1 2.2,-1.54; 2 1.8,-1.54; 3 1.4,-1.54; 4 1,-1.54; 5 0.6,-1.54; 6 0.2,-1.54; 7 -0.2,-1.54; 8 -0.6,-1.54; 9 -1,-1.54; 10 -1.4,-1.54; 11 -1.8,-1.54; 12 -2.2,-1.54; 13 -2.2,1.54; 14 -1.8,1.54; 15 -1.4,1.54; 16 -1,1.54; 17 -0.6,1.54; 18 -0.2,1.54; 19 0.2,1.54; 20 0.6,1.54; 21 1,1.54; 22 1.4,1.54; 23 1.8,1.54; 24 2.2,1.54 | smd 0.7 x 1.2: M1 -2.9,-1.5; M12 2.9,-1.5; M13 2.9,1.5; M24 -2.9,1.5
WSON-08 = smd 1 x 0.45: 1 -3.95,1.905; 2 -3.95,0.635; 3 -3.95,-0.635; 4 -3.95,-1.905; 5 3.95,-1.905; 6 3.95,-0.635; 7 3.95,0.635; 8 3.95,1.905 | smd 3.45 x 4.35: THER 0,0

### Placement (x,y rotation side)
3V3@1  13.06,30.21 180 top
BAT+1  31.03,32.48 180 top
BAT-1  32.84,31.07 180 top
C1  23.36,27.01 0 top
C2  13.66,33.01 90 top
C3  32.56,24.61 0 top
C4  13.66,22.31 180 top
C5  31.51,28.31 90 top
C6  32.46,23.21 270 top
C7  30.86,29.31 90 bottom
C8  24.76,26.51 90 top
C9  27.36,14.31 180 top
C10  7.56,31.56 180 top
C11  26.51,29.86 270 top
C12  12pF  [C0402']  18.06,18.51 270 top
C13  13.16,7.31 270 top
C14  13.56,9.71 270 top
C15  12pF  [C0402']  20.36,18.51 90 top
C16  14.06,16.91 90 top
C17  26.36,28.01 90 top
C18  32.26,25.51 0 top
C19  32.06,21.71 0 top
C20  27.26,28.21 90 top
C21  28.06,28.21 90 top
C22  36.16,17.01 270 top
C24  28.91,28.21 90 bottom
C25  28.01,28.16 90 bottom
C43  16.86,16.71 90 top
D1  10.76,14.21 180 top
D3  10.76,20.11 180 top
D4  10.76,18.91 180 top
D5  10.66,22.91 180 top
D6  10.76,16.61 180 top
D7  34.96,21.01 270 top
D8  14.26,24.01 0 top
D11  13.56,19.11 0 top
GND@1  30.96,6.61 180 top
GND@2  29.16,9.51 180 top
J1  8.06,11.31 305 top
J2  5.96,19.21 270 top
J3  19.26,4.01 180 bottom
J4  19.26,34.41 180 bottom
JMP1  12.56,20.91 0 bottom
JMP2  35.06,13.41 0 bottom
JMP3  35.96,22.91 180 bottom
JMP4  33.26,23.31 180 bottom
L1  11.66,9.71 0 top
L2  11.36,7.61 0 top
L3  15.56,16.71 270 top
MDBT1  19.26,7.91 180 top
P1  29.16,7.61 0 top
P19  27.36,9.21 180 top
P21  27.36,7.61 180 top
Q2  17.46,25.11 270 top
R1  26.06,34.46 180 top
R2  4.16,25.31 0 top
R3  26.16,35.46 0 top
R4  10.76,17.81 0 top
R5  25.11,29.21 180 top
R6  13.46,21.31 0 top
R7  36.96,22.71 180 top
R8  33.86,23.11 0 top
R9  19.36,34.61 270 top
R10  31.86,12.11 270 top
R11  20.36,34.61 270 top
R12  31.86,15.81 90 top
R13  13.66,20.11 0 top
R14  10.36,30.31 90 top
R15  17.16,27.31 180 top
R16  7.16,26.01 270 top
R17  31.86,19.81 180 top
R18  31.76,14.01 270 top
R19  37.56,21.21 270 top
R20  32.76,14.01 90 top
R21  29.76,19.41 90 top
R22  31.96,20.81 0 top
R23  23.76,20.71 90 top
R24  23.06,25.91 0 top
R25  28.66,19.11 270 top
R26  10.81,15.41 0 top
R27  25.26,19.21 270 top
R28  11.11,21.31 0 top
R29  26.16,19.21 270 top
R30  12.26,27.81 270 top
R31  11.01,12.86 0 top
R32  11.01,11.76 0 top
R33  13.16,27.81 270 top
T1  24.96,31.71 180 top
TX  27.56,10.91 180 top
U2  29.86,14.01 180 top
U3  7.78,29.01 180 top
U4  16.46,21.71 90 top
U$1  2.76,-4.69 0 top  (outside the outline)
U$2  21.86,24.31 180 top
U$3  21.86,22.01 180 top
U$5  27.56,23.51 0 top
U$6  [HEALTHYPI_MOVE_LOGO_1]  23.16,5.31 0 bottom
U$10  [PCROUNDLOGO]  11.46,32.01 0 top
U$13  [HEALTHYPI_MOVE_LOGO]  29.46,7.41 0 bottom
U$17  34.76,26.71 296 top
U$19  19.56,17.01 180 top
U$22  19.26,30.01 0 top
U$24  33.96,10.61 238 top
U$35  26.86,21.61 90 bottom
U$36  [PCROUNDLOGO]  13.26,25.21 0 bottom

### Tracks (layer width: path | path; a pad name or v marks a point on that pad's centre or on a via)
+1.8V  (via drill 0.35)
  Top 0.2: C16.1 15.25,17.45 L3.1 16.06,16.95 16.06,16.91 | R9.1 19.51,35.26 19.66,35.11 R11.1 20.86,35.61 v20.86,37.11 | U4.14 14.76,21.91 14.36,22.31 C4.1 14.16,23.01 v13.96,23.21 | U$22.2 U$22.1 | U$22.1 21.46,29.31 21.86,29.71 v21.86,29.81 | U$5.28 27.76,26.21 28.06,26.51 28.56,26.51 29.76,27.71 v29.76,29.61 | U$5.12 27.36,20.61 26.86,20.11 26.86,16.71 v26.96,16.61 | U$5.1 24.96,24.91 24.76,25.11 C8.1 24.96,26.01 25.46,26.51 25.46,27.31 25.16,27.61 21.66,27.61 21.46,27.81 U$22.1 | R8.1 33.36,23.21 33.96,23.81 33.96,24.51 35.26,25.81 35.26,26.71 v34.86,27.11 | v34.06,18.71 33.86,18.91 D7.2 | U$2.2 20.76,24.31 v20.26,24.81 | R12.2 33.06,16.31 33.66,16.91 v34.26,16.91 | R33.1 R30.1 12.26,28.61 11.26,29.61 11.26,30.31 10.76,30.81 R14.2
  Top 0.254: MDBT1.38 17.39,15.24 16.86,15.76 C43.1 | MDBT1.41 15.89,14.59 15.36,15.11 14.96,15.11 14.06,16.01 C16.1 12.91,16.26 v12.86,16.21 | C43.1 16.86,16.11 16.06,16.91 | C43.1 16.86,16.1 | R3.1 25.56,35.56 25.56,35.66 24.96,36.26 v24.96,36.61 | v33.01,12.56 32.51,12.56 32.56,12.61 R10.1 31.86,13.41 R18.2 | U3.5 8.28,31.34 C10.1 8.06,32.21 v8.36,32.51 | U3.8 5.51,29.76 v5.16,30.11 | R16.2 6.76,25.51 6.06,26.21 v6.06,26.51 | R14.2 9.56,31.61 v9.46,31.61 | C11.1 26.86,30.71 v27.66,30.71
  Route15 0.2: v20.26,24.81 19.86,25.21 19.86,27.81 v21.86,29.81
  Route15 0.254: v26.96,16.61 31.01,12.56 v33.01,12.56
  Bottom 0.2: JMP4.3 33.26,26.21 34.16,27.11 v34.86,27.11
  Bottom 0.254: JMP1.3 12.66,19.21 13.86,18.01 13.86,17.21 v12.86,16.21
  pour Route2: 39.06,4.51 0.06,4.51 0.06,39.01 39.06,39.01
+3V3  (via drill 0.35)
  Top 0.2: 19.56,30.61 19.86,30.91 U$22.20 | 21.06,30.91 20.76,30.61 19.56,30.61 | 19.56,30.61 17.22,30.61 17.06,30.77 U$22.13 | U$22.14 U$22.13 | U$5.32 26.16,27.31 C17.1 26.16,27.51 25.66,28.01 23.56,28.01 22.86,28.71 22.86,29.91 22.26,30.51 21.66,30.51 21.46,30.71 21.46,31.51 U$22.24 | U$22.13 17.06,32.31 16.76,32.61 15.76,32.61 15.36,32.21 13.71,32.21 C2.1 | U$3.2 21.09,22.11 v20.16,22.11 | 3V3@1.TP 13.66,30.21 14.38,29.49 v14.38,28.91
  Top 0.254: v12.26,33.91 12.26,33.21 13.31,32.16 C2.1 13.06,31.56 3V3@1.TP | 21.06,30.91 U$22.23 21.42,31.55 21.46,31.51
  Route2 0.2: 27.86,31.81 29.56,31.81 29.76,32.01 32.26,32.01 34.08,30.19 34.08,26.49 v34.46,26.11
  Route2 0.254: 27.86,31.81 25.66,34.01 25.66,35.21 25.16,35.71 13.46,35.71 12.26,34.51 v12.26,33.91
  Bottom 0.2: v14.38,28.91 14.86,28.91 16.76,27.01 16.76,25.51 17.26,25.01 18.66,25.01 20.16,23.51 v20.16,22.11 | 34.36,22.11 34.41,22.16 34.41,26.06 v34.46,26.11
  Bottom 0.254: JMP4.1 33.86,21.61 34.36,22.11
ACC_INT1  (via drill 0.35)
  Top 0.152: v17.06,8.02 17.06,8.21 16.26,9.01
  Top 0.2: MDBT1.55 16.26,9.01
  Top 0.254: U3.4 10.21,29.76 R14.1 11.26,28.91 v11.26,27.81
  Route15 0.254: v11.26,27.81 11.26,27.61 6.96,23.31 6.96,19.61 4.66,17.31 4.66,9.31 5.86,8.11 16.97,8.11 v17.06,8.02
CC1  (via drill 0.35)
  Top 0.2: U$5.23 30.26,24.51 30.56,24.81 30.56,26.51 v30.66,26.61
  Top 0.254: J2.A5 8.36,20.21 9.26,21.11 v9.46,21.11 9.46,21.31 R28.1
  Route2 0.254: v5.06,27.71 7.06,27.71 11.66,32.31 24.36,32.31 30.06,26.61 v30.66,26.61
  Bottom 0.254: v9.46,21.11 9.36,21.21 9.36,23.91 7.16,26.11 7.16,27.01 6.46,27.71 v5.06,27.71
CC2  (via drill 0.35)
  Top 0.2: U$5.24 29.76,24.99 29.76,25.91 v29.66,26.01
  Top 0.254: J2.B5 2.71,18.46 v2.46,18.71 | R26.1 8.56,15.41 v8.36,15.21
  Route2 0.254: v29.66,26.01 29.66,26.41 24.26,31.81 11.96,31.81 7.16,27.01 7.16,26.41 5.56,24.81 4.26,24.81 3.56,24.11 3.56,23.31 2.86,22.61 1.86,22.61 0.76,21.51 0.76,20.41 v2.46,18.71
  Bottom 0.254: v8.36,15.21 8.36,16.11 6.06,18.41 2.76,18.41 v2.46,18.71
CS
  Top 0.254: U3.12 7.28,26.63 R16.1
ECG_CS  (via drill 0.35)
  Top 0.2: v15.46,6.01 15.46,6.51 15.76,6.81 15.76,7.11 MDBT1.59
  Bottom 0.2: v15.46,6.01 16.75,4.73 17.28,4.73 17.46,4.91 J3.2
ECG_INT2B  (via drill 0.35)
  Top 0.2: v22.36,5.21 MDBT1.3
  Bottom 0.2: J3.20 21.06,5.98 21.26,6.18 21.89,6.18 22.36,5.71 v22.36,5.21
ECG_INTB  (via drill 0.35)
  Top 0.2: v19.16,7.91 19.16,7.81 20.24,6.74 MDBT1.64
  Bottom 0.152: J3.14 19.86,7.11 19.16,7.81 v19.16,7.91
GND  (via drill 0.35)
  Top 0.152: D1.1 10.96,13.83 10.96,13.41
  Top 0.2: U2.2 30.71,13.56 31.16,13.11 31.16,12.01 30.36,11.21 | 19.66,21.51 U4.6 | 7.28,29.51 U3.7 7.43,30.21 7.49,30.27 7.57,30.27 7.63,30.21 U3.6 | 23.86,15.51 23.39,15.04 MDBT1.24 | v12.26,24.81 12.46,24.61 12.46,23.41 13.16,22.71 C4.2 13.46,22.01 13.46,20.41 R13.1 | D5.1 11.24,23.23 10.16,24.31 v10.16,24.81 | C12.2 17.56,18.91 17.76,19.11 | C16.2 14.71,18.21 16.66,18.21 | MDBT1.1 26.01,4.66 27.16,5.81 27.16,5.91 27.86,6.61 28.06,6.61 | C14.2 13.26,8.91 10.26,8.91 9.56,8.21 | R15.1 17.86,27.51 U$22.10 | R24.1 21.46,25.91 v21.31,25.76 | U$22.22 20.66,32.41 | R28.2 11.76,20.53 D3.1 | C5.2 30.96,29.36 30.96,30.71 v30.76,30.91
  Top 0.254: U3.3 U3.2 U3.1 | MDBT1.42 14.84,14.46 14.49,14.81 13.66,14.81 v13.26,14.41 | U3.7 7.28,31.34 C10.2 | J2.B12 5.07,22.41 | 5.07,22.41 J2.S5 | J2.A1 5.27,22.21 5.07,22.41 | J2.S3 5.07,22.64 J2.S5 | J2.S1 4.18,23.53 v4.36,23.71 4.36,23.22 J2.S5 | C5.2 32.11,28.21 32.16,28.21
  Bottom 0.2: JMP1.1 12.56,23.11 13.16,23.71 | 15.56,5.01 16.66,3.91 18.66,3.91 19.06,3.51 J3.9 J3.11 | J4.19 21.06,32.31 | U$35.4 24.96,18.11 25.46,18.61 29.06,18.61 29.86,17.81 30.16,17.81 30.56,17.41 30.56,16.81
  Bottom 0.254: J4.16 20.26,35.11
  other vias: 33.66,11.61 30.86,5.01 5.76,12.91 12.26,36.01 25.56,15.01 15.46,26.71 9.06,7.01 11.16,35.41 14.76,34.61 27.66,35.61 22.56,33.51 30.96,18.71 26.96,24.01 28.06,24.01 26.96,22.71 28.06,22.71 35.16,28.21 10.16,27.61
  pour Top: 39.06,39.01 0.06,39.01 0.06,4.51 39.06,4.51
  pour Bottom: 39.06,39.01 0.06,39.01 0.06,4.51 39.06,4.51
  pour Route15: 39.06,4.51 0.06,4.51 0.06,39.01 39.06,39.01
GP0  (via drill 0.35)
  Top 0.2: U$5.7 24.76,22.51 24.56,22.31 24.56,19.11 24.06,18.61 v24.06,18.51
  Bottom 0.2: JMP2.1 34.76,15.11 34.16,15.11 33.69,14.64 v33.69,14.51
  Bottom 0.254: v24.06,18.51 24.56,19.01 29.56,19.01 30.96,17.61 30.96,16.91 31.56,16.31 33.56,16.31 34.76,15.11
GP1  (via drill 0.35)
  Top 0.2: MDBT1.32 19.64,15.36 v19.71,15.36 | R27.2 25.26,18.41 24.46,17.61 23.9,17.61 v23.69,17.4
  Route2 0.254: v19.71,15.36 19.71,15.46 20.46,16.21 21.56,16.21 22.06,15.71 23.06,15.71 23.69,16.34 v23.69,17.4
GP2  (via drill 0.35)
  Top 0.2: v24.76,12.41 24.74,12.39 MDBT1.20 | R29.2 25.96,18.51 25.96,16.11 v26.36,15.71
  Route2 0.2: v24.76,12.41 24.76,13.11 26.36,14.71 v26.36,15.71
N$1  (via drill 0.35)
  Top 0.254: J2.B8 2.91,19.96 2.67,19.72 v2.56,19.72 | v3.86,26.51 3.51,26.16 R2.1
  Bottom 0.254: v2.56,19.72 2.87,20.03 2.87,22.62 3.46,23.21 3.46,26.11 v3.86,26.51
N$2
  Top 0.254: J2.A8 6.96,18.21 7.36,17.81 R4.1
N$3
  Top 0.2: U$5.17 30.29,22.11 30.59,21.81 30.59,20.54 31.21,19.91 R17.2
N$4
  Top 0.2: U$5.16 28.96,20.86 R21.2
N$5
  Top 0.254: MDBT1.12 23.41,9.49 25.79,9.49 26.26,9.01 26.26,8.21 26.86,7.61 P21.TP
N$6
  Top 0.2: U$5.8 25.44,19.89 R27.1
N$7  (via drill 0.35)
  Top 0.2: U$5.6 24.51,22.91 23.76,22.16 R23.2 23.01,20.61 21.06,20.61 v20.96,20.51 | C17.2 23.76,28.51 23.66,28.61 v23.66,29.01 | C3.2 33.06,24.81 33.36,25.11 v33.36,27.31
  Route15 0.2: v20.96,20.51 22.26,20.51 23.66,21.91 v23.66,29.01
  Bottom 0.254: v33.36,27.31 33.36,30.11 31.66,31.81 26.96,31.81 24.16,29.01 v23.66,29.01
N$8  (via drill 0.35)
  Top 0.2: R31.1 9.61,12.86 v9.36,13.11
  Top 0.254: J2.B6 5.71,18.96 J2.A6 8.96,19.71 9.06,19.81 v9.16,19.81 9.88,19.81 D3.2
  Bottom 0.254: v9.16,19.81 9.16,19.51 9.96,18.71 9.96,13.71 v9.36,13.11
N$9  (via drill 0.35)
  Top 0.2: J2.A7 7.47,18.71 v7.56,18.62 7.56,18.81 7.76,19.01 | R32.1 9.51,11.76 8.26,13.01 v8.26,13.41
  Top 0.254: D4.2 10.08,19.01 7.76,19.01 | J2.B7 4.01,19.46 v3.76,19.21 | R32.1 10.26,11.86
  Route2 0.2: 8.46,18.62 v7.56,18.62
  Route2 0.254: 8.46,18.62 9.36,17.72 9.36,14.51 8.67,13.82 v8.26,13.41
  Bottom 0.254: v7.56,18.62 6.96,19.22 v3.77,19.22 v3.76,19.21
N$18  (via drill 0.35)
  Top 0.2: v17.36,29.91 17.46,29.81 U$22.11 | R5.2 24.61,29.26 23.76,30.11 v23.56,30.11
  Top 0.254: U$22.12 U$22.11
  Route2 0.2: v17.36,29.91 17.36,30.11 17.86,30.61 22.16,30.61 22.66,30.11 v23.56,30.11
N$21
  Top 0.254: 24.86,30.51 T1.C 24.96,30.26 25.61,29.61 R5.1
N$23
  Top 0.254: T1.B 26.56,33.46 R1.1 26.66,34.56 R3.2
N$25
  Top 0.2: U$5.5 23.76,23.31 22.54,22.09 U$3.1
N$26
  Top 0.2: U4.15 14.56,21.51 14.16,21.11 R13.2 14.11,20.16 R6.2
N$28
  Top 0.254: MDBT1.34 18.89,15.64 19.66,16.41 20.21,16.41 U$19.P$2 20.81,18.46 C15.2
N$29  (via drill 0.35)
  other vias: 22.46,37.01
N$30  (via drill 0.35)
  Top 0.254: C9.1 28.01,14.41 29.11,15.51 U2.5 31.06,17.16 31.77,17.16 v31.86,17.25 | D7.3 36.36,20.71 R19.2 37.66,20.61 37.66,19.85 v37.7,19.81
  Bottom 0.254: v37.7,19.81 35.81,17.91 33.66,17.91 33,17.25 v31.86,17.25
N$31
  Top 0.254: U2.3 30.46,14.51 R18.1 R20.2
N$32
  Top 0.254: D7.1 34.08,21.89 | 34.08,21.89 34.17,21.86 | R7.2 35.36,22.71 34.53,21.89 34.08,21.89
N$33
  Top 0.254: R19.1 37.46,21.81 | 37.46,21.81 R7.1 | 37.46,21.81 37.26,22.01 35.26,22.01 34.96,21.71 34.96,19.41 35.96,18.41 C22.1
N$34
  Top 0.254: MDBT1.36 18.14,15.39 18.31,15.56 U$19.P$1 18.4,17.11 C12.1
N$36
  Top 0.254: MDBT1.40 16.64,14.94 15.6,15.98 L3.2
N$37  (via drill 0.35)
  Top 0.254: v15.06,23.01 15.27,22.8 U4.13
  Bottom 0.254: JMP1.2 13.76,20.91 15.26,22.41 15.26,22.81 v15.06,23.01
N$38
  Top 0.254: MDBT1.50 11.94,10.89 10.93,9.88 L1.1
N$39
  Top 0.254: MDBT1.52 13.64,10.14 C14.1 12.9,10.21 L1.2
N$40
  Top 0.254: MDBT1.54 14.64,9.39 14.26,9.01 14.26,8.81 13.96,8.51 11.36,8.51 10.63,7.78 L2.1
N$41
  Top 0.254: MDBT1.58 13.24,7.89 C13.1 12.3,7.81 L2.2
N$42
  Top 0.2: U$5.3 22.74,24.11 U$2.1
N$43
  Top 0.254: Q2.2 15.56,24.16 D8.A
N$44  (via drill 0.35)
  Top 0.2: U$5.19 30.86,22.91 31.16,22.61 v31.46,22.61 31.56,22.51 C19.1
  Top 0.254: v31.96,29.81 31.96,30.01 31.53,30.44 31.53,31.98 BAT+1.TP
  Route2 0.254: v31.96,29.81 31.96,25.61 32.26,25.31 32.26,23.31 31.56,22.61 v31.46,22.61
N$45
  Top 0.2: U$5.9 R29.1
N$46
  Top 0.2: U$5.2 24.06,24.51 23.71,24.86 R24.2
  Top 0.254: R24.2 23.71,26.86 C1.2 C8.2
N$50
  Top 0.2: U$5.18 30.56,22.51 30.96,22.11 30.96,21.21 31.36,20.81 R22.1
N$51
  Top 0.2: U$5.15 28.56,19.71 R25.1
N$52
  Bottom 0.2: 29.01,25.56 29.11,25.56 29.76,24.91 31.36,24.91 32.96,23.31 JMP4.2
  Bottom 0.254: C25.1 28.06,27.71 | C25.1 28.21,27.46 28.21,26.56 28.77,26.01 U$35.8 29.01,25.56 | C25.1 28.86,27.66 C24.1 29.21,27.71 30.16,28.66 C7.1
P19
  Top 0.254: MDBT1.14 25.94,10.14 26.86,9.21 P19.TP
PPG_POWER  (via drill 0.35)
  Top 0.254: Q2.3 18.36,25.21 18.36,25.35 v17.74,25.97
  Route15 0.2: v15.56,33.91 15.86,33.61 15.86,28.95 17.74,27.07 v17.74,25.97
  Bottom 0.2: v15.56,33.91 15.66,33.81 15.66,33.01 16.56,32.11 17.16,32.11 17.46,32.41 J4.1 J4.3
QSPI-0  (via drill 0.35)
  Top 0.2: MDBT1.21 22.26,12.66 22.11,12.66 20.96,11.51 v20.66,11.51
  Bottom 0.254: U$35.5 24.96,25.51 23.36,23.91 23.36,20.31 21.56,18.51 21.56,14.61 20.16,13.21 20.16,12.01 v20.66,11.51
QSPI-1  (via drill 0.35)
  Top 0.2: MDBT1.27 21.51,13.26 21.06,12.81 v21.06,12.61
  Bottom 0.254: v21.06,12.61 22.16,13.71 25.46,13.71 27.7,15.95 27.7,17.46 U$35.2
QSPI-2  (via drill 0.35)
  Top 0.152: MDBT1.23 22.56,13.71 23.86,13.71 v24.61,14.46
  Bottom 0.254: U$35.3 26.23,17.48 24.61,15.86 v24.61,14.46
QSPI-3  (via drill 0.35)
  Top 0.2: MDBT1.28 21.14,14.69
  Top 0.254: 21.14,14.69 21.96,15.51 21.96,17.11 v22.86,18.01
  Bottom 0.254: U$35.7 26.15,24.21 25.06,24.21 24.36,23.51 24.36,19.91 22.86,18.41 v22.86,18.01
QSPI-CLK  (via drill 0.35)
  Top 0.2: MDBT1.26 21.89,14.64
  Top 0.254: v22.76,16.51 22.96,16.31 22.96,15.71 21.89,14.64
  Bottom 0.254: U$35.6 25.38,24.71 24.86,24.71 23.86,23.71 23.86,20.11 22.06,18.31 22.06,17.21 v22.76,16.51
QSPI-CS  (via drill 0.35)
  Top 0.152: MDBT1.16 24.34,10.89 v24.36,10.91
  Bottom 0.254: U$35.1 28.77,17.36 28.17,16.76 28.17,15.82 25.56,13.21 24.16,13.21 23.56,12.61 23.56,11.71 v24.36,10.91
RESET1  (via drill 0.35)
  Top 0.2: MDBT1.6 25.54,7.14 v26.46,6.21 | P1.TP 29.56,7.61 30.66,8.71 v30.66,9.1
  Bottom 0.2: v30.66,9.1 29.35,9.1 v26.46,6.21
RTC_INT  (via drill 0.35)
  Top 0.152: MDBT1.35 18.51,10.66 18.76,10.41 v18.86,10.41
  Top 0.2: U2.4 31.81,15.36 R12.1 32.96,15.31 v33.16,15.51
  Route2 0.2: v33.16,15.51 31.66,14.01 28.66,14.01 27.56,12.91 27.56,11.11 26.26,9.81 22.76,9.81 22.56,9.61 19.66,9.61 v18.86,10.41
S_INT  (via drill 0.35)
  Top 0.2: U4.9 17.86,23.29 v17.86,24.11
  Route15 0.2: v17.86,24.11 17.86,24.71 16.76,25.81 16.76,27.41 15.46,28.71 15.46,31.21 13.46,33.21 13.46,34.91 14.96,36.41 v14.96,36.71
  Bottom 0.2: v14.96,36.71 14.96,37.07 15.6,37.71 18.06,37.71 18.66,37.11 J4.8
S_SCL  (via drill 0.35)
  Top 0.2: U4.3 16.66,20.43 17.54,19.56 19.91,19.56 v19.96,19.61
  Route15 0.2: v16.06,37.01 16.26,36.81 16.26,29.11 17.56,27.81 19.06,27.81 19.46,27.41 19.46,24.61 21.06,23.01 21.06,21.61 20.26,20.81 20.26,19.91 v19.96,19.61
  Bottom 0.2: J4.6 18.26,36.91 17.86,37.31 16.36,37.31 v16.06,37.01
S_SDA  (via drill 0.35)
  Top 0.2: U4.16 15.29,20.44 v15.06,20.21
  Route15 0.2: v15.06,20.21 16.26,21.41 16.26,23.21 12.06,27.41 12.06,31.71 13.06,32.71 13.06,35.81 v13.76,36.51
  Bottom 0.152: J4.4 17.86,36.51 17.56,36.81 16.96,36.81
  Bottom 0.2: v13.76,36.51 14.46,35.81 15.96,35.81 16.96,36.81
SBU  (via drill 0.35)
  Top 0.254: R4.2 11.71,17.51 v12.36,17.51 | D8.C 13.11,25.06 12.56,25.61 v11.46,25.61 8.86,25.61 7.96,24.71 5.41,24.71 R2.2
  Bottom 0.254: v12.36,17.51 11.36,17.51 10.76,18.11 10.76,24.31 11.46,25.01 v11.46,25.61
SEN_MFIO  (via drill 0.35)
  Top 0.152: 20.99,6.81 20.1,7.69 v20.19,7.78
  Top 0.2: 20.99,6.81 MDBT1.63
  Bottom 0.152: J3.16 20.26,7.71 v20.19,7.78
SEN_MISO  (via drill 0.35)
  Top 0.2: v26.26,11.81 25.36,11.81 25.19,11.64 MDBT1.18
  Bottom 0.2: J3.15 20.26,3.41 20.66,3.81 22.46,3.81 23.56,4.91 23.56,9.01 24.06,9.51 25.26,9.51 26.46,10.71 26.46,11.61 v26.26,11.81
SEN_MOSI  (via drill 0.35)
  Top 0.2: v20.36,10.31 20.46,10.31 22.16,12.01 MDBT1.19
  Bottom 0.152: J3.8 18.66,4.41 18.86,4.21 22.36,4.21 23.16,5.01 23.16,8.31 21.94,9.54 20.74,9.54 20.36,9.91 v20.36,10.31
SEN_RST  (via drill 0.35)
  Top 0.2: v24.35,8.51 24.23,8.64 MDBT1.10
  Bottom 0.2: J3.19 21.06,3.06 21.3,3.3 22.83,3.38 23.96,4.51 23.96,8.12 v24.35,8.51
SEN_SCK  (via drill 0.35)
  Top 0.152: 20.76,13.31 20.36,12.91 20.36,12.21 19.96,11.81 19.96,11.01 19.56,10.61 19.56,10.11 19.16,9.71 18.66,9.71 18.36,9.41 18.36,6.91 v18.26,6.81
  Top 0.2: MDBT1.29 20.76,13.31
  Bottom 0.152: v18.26,6.81 17.86,6.41 J3.4
SEN_SCL  (via drill 0.35)
  Top 0.152: 22.36,8.36 22.01,8.36 21.49,8.88 v21.42,8.88
  Top 0.2: MDBT1.9 22.36,8.36 | U$5.14 28.16,20.21 27.86,19.91 27.86,18.21 29.06,17.01 v29.76,17.01 | R33.2 13.07,27.22 13.07,26.91 12.47,26.31 8.26,26.31 v8.21,26.26
  Top 0.254: U2.7 29.01,13.56 28.26,12.81 v28.26,12.61 | U3.13 7.78,27.09 8.21,26.66 v8.21,26.26
  Route2 0.2: v21.42,8.88 22.62,8.88 23.15,9.41 26.46,9.41 | v8.21,26.26 8.21,27.36 12.26,31.41 24.06,31.41 28.86,26.61 28.86,25.71 30.76,23.81 30.76,22.21 31.36,21.61 31.36,20.61 29.36,18.61 29.36,17.41 v29.76,17.01
  Route2 0.203: v28.26,12.61 28.28,12.61 28.28,11.23 26.46,9.41
  Bottom 0.152: J3.18 20.66,6.21 21.06,6.61 22.16,6.61 22.26,6.71 22.26,8.71 22.06,8.91 21.45,8.91 v21.42,8.88
  Bottom 0.2: v29.76,17.01 29.76,14.11 v28.26,12.61
SEN_SDA  (via drill 0.35)
  Top 0.2: v25.46,8.51 24.74,7.79 23.41,7.79 MDBT1.8 | U$5.13 27.76,20.41 27.26,19.91 27.26,18.21 28.96,16.51 v28.96,16.31 | R30.2 11.86,26.91 9.26,26.91 v9.16,27.01
  Top 0.254: U2.8 29.16,12.56 v29.16,11.61 | U3.14 9.08,27.01 v9.16,27.01
  Route2 0.2: v9.16,27.01 9.16,27.71 12.46,31.01 23.96,31.01 28.46,26.51 28.46,25.51 30.36,23.61 30.36,22.11 30.96,21.51 30.96,20.71 28.96,18.71 v28.96,16.31
  Bottom 0.2: J3.17 20.66,2.01 20.96,1.71 22.06,1.71 24.36,4.01 24.36,7.31 25.46,8.41 v25.46,8.51 | v28.96,16.31 28.96,15.51 27.16,13.71 27.16,12.31 27.86,11.61 v29.16,11.61
  Bottom 0.254: v29.16,11.61 29.16,10.71 26.96,8.51 v25.46,8.51
SENSOR_BRD_SUPPLY  (via drill 0.35)
  Top 0.2: 27.86,27.51 C21.1 C20.1 v27.16,26.81 27.36,26.71 U$5.29
  Route15 0.254: v27.16,26.81 28.96,28.51 31.16,28.51 32.36,27.31 32.36,26.01 34.56,23.81 34.56,20.38 35.66,19.28 35.66,11.91 30.86,7.11 24.66,7.11 23.86,6.31 23.86,4.81 21.86,2.81 16.66,2.81 v13.96,5.51
  Bottom 0.152: 16.16,3.63 14.28,5.51 v13.96,5.51
  Bottom 0.2: J4.5 18.26,32.31 18.66,31.91 21.46,31.91 22.86,30.51 22.86,28.61 24.66,26.81 v27.16,26.81 | J3.5 J3.3 J3.1 17.46,3.31 17.36,3.41 16.38,3.41 16.16,3.63
  Bottom 0.254: J4.9 J4.7 J4.5
SHPHLD  (via drill 0.35)
  Top 0.2: R25.2 29.46,17.81 31.16,17.81 31.61,18.26 v32.11,18.26
  Bottom 0.2: JMP3.3 35.46,24.61 34.76,23.91 34.76,20.31 33.86,19.41 33.76,19.41 33.38,19.03 33.38,18.63 33.01,18.26 v32.11,18.26
SW1  (via drill 0.35)
  Top 0.152: MDBT1.39 17.01,13.06 17.16,12.91 v17.16,12.31
  Top 0.2: MDBT1.39 17.11,13.41
  Route2 0.2: v32.86,10.81 32.36,11.31 31.16,11.31 27.06,7.21 22.66,7.21 20.76,5.31 17.46,5.31 16.06,6.71 16.06,10.91 17.16,12.01 v17.16,12.31
  Bottom 0.2: JMP2.3 34.16,10.81 v32.86,10.81
SW3  (via drill 0.35)
  Top 0.2: MDBT1.30 20.39,14.74 20.76,15.11 v20.76,15.41 20.76,15.31
  Route2 0.2: v20.76,15.41 20.96,15.41 23.06,13.31 23.06,10.91 23.76,10.21 25.96,10.21 27.16,11.41 27.16,13.21 28.36,14.41 30.66,14.41 34.16,17.91 35.06,17.91 36.01,18.86 v36.01,19.93
  Bottom 0.254: JMP3.1 35.96,20.41 36.23,20.15 v36.01,19.93
SW11  (via drill 0.35)
  Top 0.2: U$24.2 v31.85,10.51 31.85,11.6 R10.2
  Bottom 0.2: JMP2.2 32.46,13.41 31.86,12.81 31.86,10.52 v31.85,10.51
SW33  (via drill 0.35)
  Top 0.2: v36.16,26.11 36.16,26.01 35.45,25.3 35.45,24.28 U$17.2
  Top 0.254: U$17.2 34.58,23.41 R8.2
  Bottom 0.2: JMP3.2 36.56,22.91 37.06,23.41 37.06,25.41 36.36,26.11 v36.16,26.11
SW_D1  (via drill 0.35)
  Top 0.2: U4.2 16.26,20.34 16.86,19.74 16.86,19.01 16.56,18.71 15.46,18.71 15.26,18.91 v15.16,18.91 14.96,19.11 D11.2
  Top 0.254: J2.B2 3.91,16.96 v3.66,16.71 | v8.26,22.61 7.86,22.61 6.96,21.71 J2.A2
  Route2 0.2: v3.66,16.71 5.06,18.11 5.06,19.71 7.56,22.21 7.86,22.21 v8.26,22.61 10.06,22.61 12.96,19.71 14.36,19.71 v15.16,18.91
SW_D2  (via drill 0.35)
  Top 0.2: U4.5 18.26,21.11 18.46,20.91 v18.46,20.61
  Top 0.254: J2.B3 1.61,17.46 v1.46,17.31 | v7.06,13.61 7.86,14.41 9.98,14.41 D1.2 | v7.86,21.51 7.56,21.21 J2.A3
  Route2 0.254: v7.86,21.51 8.36,21.51 8.76,21.91 10.06,21.91 12.66,19.31 13.36,19.31 14.56,18.11 16.76,18.11 18.46,19.81 v18.46,20.61
  Bottom 0.254: v1.46,17.31 1.86,17.31 3.96,15.21 3.96,14.21 4.46,13.71 6.96,13.71 v7.06,13.61 7.86,14.41 8.66,14.41 9.26,15.01 9.26,18.61 7.86,20.01 v7.86,21.51
SW_D3  (via drill 0.35)
  Top 0.2: U4.7 18.36,21.91 v18.66,22.21
  Top 0.254: D6.2 9.38,16.61 8.88,16.11 7.66,16.11 v7.46,15.91 7.46,16.31 7.06,16.71 J2.A11 | J2.B11 4.67,21.46 4.07,22.06 2.91,22.06 v2.16,21.31
  Route2 0.2: v18.66,22.21 17.86,22.21 16.96,23.11 16.96,24.81 15.96,25.81 14.86,25.81 13.96,26.71 10.36,26.71 7.56,23.91 7.56,22.81 5.36,20.61 3.36,20.61 2.66,21.31 v2.16,21.31
  Bottom 0.254: v2.16,21.31 1.66,20.81 1.66,18.41 2.16,17.91 5.76,17.91 7.46,16.21 v7.46,15.91
SW_D4  (via drill 0.35)
  Top 0.2: v15.46,25.11 16.76,25.11 17.16,24.71 17.16,23.79 16.66,23.29 U4.10
  Top 0.254: J2.B10 4.01,20.96 v3.66,21.31 | D5.2 10.08,23.01 9.38,23.71 v8.46,23.71 | v8.46,17.01 8.26,17.21 J2.A10
  Route2 0.2: v15.46,25.11 14.96,25.11 13.76,26.31 10.66,26.31 8.46,24.11 v8.46,23.71
  Bottom 0.254: v8.46,23.71 8.16,23.71 7.06,22.61 7.06,20.21 7.46,19.81 | v8.46,17.01 8.56,17.11 8.56,18.71 7.46,19.81 | 7.46,19.81 4.36,19.81 3.66,20.51 v3.66,21.31
SWCLK1  (via drill 0.35)
  Top 0.2: MDBT1.2 24.24,5.64 24.5,5.37 v25.73,5.37 | U4.4 17.06,20.61 17.76,19.91 19.06,19.91 19.56,20.41 v19.56,20.71
  Top 0.254: v6.26,9.81 6.76,10.31 7.66,10.31 8.25,10.9 J1.3
  Route2 0.254: v25.73,5.37 24.07,3.71 13.86,3.71 8.96,8.61 6.96,8.61 6.26,9.31 v6.26,9.81 7.96,11.51 8.96,11.51 10.56,13.11 10.56,17.81 11.56,18.81 13.06,18.81 14.26,17.61 16.86,17.61 19.56,20.31 v19.56,20.71
SWDIO1  (via drill 0.35)
  Top 0.2: v25.13,6.2 24.94,6.39 MDBT1.4 | U4.1 15.86,20.01 16.06,19.81 16.06,19.41 v16.16,19.41
  Top 0.254: v7.36,9.41 8.25,9.41 J1.4
  Route2 0.254: v25.13,6.2 24.45,6.2 22.46,4.21 14.16,4.21 9.16,9.21 7.56,9.21 v7.36,9.41
  Route15 0.254: v16.16,19.41 16.16,18.41 7.36,9.61 v7.36,9.41
TFT_BL  (via drill 0.35)
  Top 0.152: MDBT1.22 23.69,13.14 23.96,13.41 25.96,13.41 v26.46,12.91
  Top 0.2: v24.36,34.91 25.11,34.91 R1.2
  Route2 0.2: v26.46,12.91 26.46,13.21 28.16,14.91 30.56,14.91 33.16,17.51 33.16,25.91 32.66,26.41 32.66,28.21 33.16,28.71 33.16,30.31 31.86,31.61 30.26,31.61 30.06,31.41 27.56,31.41 24.36,34.61 v24.36,34.91
TFT_CS  (via drill 0.35)
  Top 0.152: 22.26,9.01 21.66,9.61 19.76,9.61 19.16,9.01 v19.06,9.01
  Top 0.2: MDBT1.11 22.26,9.01 | v18.66,27.11 19.56,27.11 20.26,27.81 U$22.4
  Route15 0.152: v18.66,27.11 18.96,26.81 18.96,24.51 19.36,24.11 19.36,21.91 18.96,21.51 18.16,21.51 17.56,20.91 17.56,14.01 18.16,13.41 18.16,9.81 18.96,9.01 v19.06,9.01
TFT_DC  (via drill 0.35)
  Top 0.152: MDBT1.43 15.96,13.71 14.56,13.71 v14.26,14.01
  Top 0.2: v18.46,29.91 18.46,29.51 18.66,29.31 U$22.8
  Route2 0.2: v14.26,14.01 14.06,14.21 14.06,15.61 14.76,16.31 18.66,16.31 22.56,20.21 22.56,23.51 19.46,26.61 19.46,28.91 v18.46,29.91
TFT_MOSI  (via drill 0.35)
  Top 0.152: MDBT1.51 16.46,10.51 16.88,10.09 v17.24,10.09
  Top 0.2: MDBT1.51 16.26,10.51 | v19.56,29.91 19.56,29.81 19.06,29.31 U$22.7
  Bottom 0.2: v17.24,10.09 17.24,10.23 15.86,11.61 15.86,13.91 22.36,20.41 22.36,27.11 v19.56,29.91
TFT_RST  (via drill 0.35)
  Top 0.2: U$22.3 20.66,27.21 v20.56,27.11
  Top 0.254: MDBT1.65 18.69,5.81 17.46,5.81 16.86,6.41 v16.86,6.91
  Bottom 0.2: v16.86,6.91 15.46,8.31 15.46,14.01 21.66,20.21 21.66,24.41 20.56,25.51 v20.56,27.11
TFT_SCK  (via drill 0.35)
  Top 0.2: MDBT1.47 16.36,12.01 17.17,11.21 v17.33,11.21 | v20.76,29.81 20.56,29.81 19.86,29.11 U$22.5
  Bottom 0.2: v17.33,11.21 17.13,11.21 16.36,11.98 16.36,13.91 22.76,20.31 22.76,27.21 20.76,29.21 v20.76,29.81
TP_INT  (via drill 0.35)
  Top 0.152: 22.26,7.51 21.56,8.21 20.86,8.21 v20.16,8.91
  Top 0.2: MDBT1.7 22.26,7.51 | v17.36,34.11 17.36,33.81 18.26,32.91 U$22.16
  Route15 0.2: v17.36,34.11 17.36,34.81 18.26,35.71 22.56,35.71 25.66,32.61 25.66,17.11
  Route15 0.203: 25.66,17.11 22.36,13.81 22.36,10.21 arc-90 21.76,9.61 20.86,9.61 arc90 v20.16,8.91
TP_RST  (via drill 0.35)
  Top 0.152: MDBT1.5 22.31,6.76 21.76,7.31 21.66,7.31
  Top 0.2: 21.66,7.31 21.46,7.31 v21.26,7.51 | v23.56,36.51 23.56,35.51 21.46,33.41 20.36,33.41 19.46,32.51 U$22.19
  Route15 0.2: 26.06,16.91 26.06,34.21 24.66,35.61 24.26,35.61 23.56,36.31 v23.56,36.51
  Route15 0.203: 26.06,16.91 22.86,13.71 22.86,9.01 21.36,7.51 v21.26,7.51
TP_SCL  (via drill 0.35)
  Top 0.152: MDBT1.31 20.01,12.36 19.26,11.61 v19.26,11.41
  Top 0.2: v18.36,34.61 18.86,34.11 R9.2 19.36,33.61 18.66,32.91 U$22.17
  Route15 0.2: v19.26,11.41 20.16,12.31 20.16,12.81 20.86,13.51 21.45,13.51 25.26,17.32 25.26,32.41 22.36,35.31 19.06,35.31 v18.36,34.61
TP_SDA  (via drill 0.35)
  Top 0.2: MDBT1.33 v19.26,12.61 | v21.36,34.41 20.66,34.41 R11.2 20.36,34.01 19.06,32.71 U$22.18
  Route15 0.2: v19.26,12.61 20.66,14.01 21.36,14.01 24.86,17.51 24.86,32.21 22.66,34.41 v21.36,34.41
UART_TX  (via drill 0.35)
  Top 0.2: J1.2 7.86,11.81 8.86,11.81 9.96,10.71 v10.06,10.71 | v18.66,23.41 17.69,22.44 U4.8
  Top 0.254: TX.TP 25.66,10.91 v25.56,11.01 | MDBT1.13 22.11,9.76 21.56,10.31 v21.46,10.31
  Route2 0.2: v21.46,10.31 22.56,11.41 22.56,12.91 21.76,13.71 17.06,13.71 14.76,11.41 10.76,11.41 | 10.76,11.41 v10.06,10.71 | 10.76,11.41 10.56,11.41 11.66,12.51 11.66,13.81 14.56,16.71 18.46,16.71 21.86,20.11 21.86,21.61 20.06,23.41 v18.66,23.41
  Bottom 0.254: v25.56,11.01 24.66,10.11 21.66,10.11 v21.46,10.31
USB_D+
  Top 0.254: MDBT1.46 14.81,12.39 14.61,12.19 13.19,12.19 12.61,12.76 11.76,12.76 R31.2
USB_D-
  Top 0.254: MDBT1.48 11.79,11.64 R32.2
VBUS  (via drill 0.35)
  Top 0.2: U$5.22 30.36,24.11 31.06,24.81 31.06,25.91 31.56,26.41 31.56,26.71 v30.56,27.71
  Top 0.254: MDBT1.44 14.09,13.14 v13.86,12.91
  Route15 0.2: 19.16,6.91 17.96,8.11
  Route15 0.254: v30.56,27.71 31.16,27.71 31.76,27.11 31.76,25.91 34.06,23.61 34.06,20.11 35.16,19.01 35.16,12.01 30.76,7.61 24.36,7.61 23.26,6.51 23.26,5.01 21.76,3.51 20.46,3.51 19.16,4.81 19.16,6.91 | 17.96,8.11 17.96,8.51 17.46,9.01 15.66,9.01 13.86,10.81 v13.86,12.91
VCC  (via drill 0.35)
  Top 0.2: C3.1 32.06,24.51 31.96,24.41 32.46,23.91 C6.1 32.43,23.68 v31.49,23.68 31.12,23.31 U$5.20 | U$5.4 23.46,23.71 22.96,23.21 20.66,23.21 19.56,24.31 19.56,25.41 20.36,26.21 20.66,26.21 21.33,26.88 v21.63,26.88 21.66,26.91 22.76,26.91 C1.1
  Route2 0.2: v29.68,21.31 25.36,21.31 23.86,22.81 23.86,25.71 22.69,26.88 v21.63,26.88
  Bottom 0.2: v31.49,23.68 31.13,23.68 29.76,22.31 29.76,21.31 v29.68,21.31
VUSB2  (via drill 0.35)
  Top 0.2: R6.1 12.81,21.51 12.01,22.31 | 12.01,22.11 9.46,22.11 | U$5.21 30.46,23.71 31.46,24.71 31.46,25.21 C18.1
  Top 0.254: Q2.1 16.66,26.26 R15.2 16.46,27.51 v14.66,27.51 | J2.A9 5.86,17.71 5.61,17.96 J2.B4 2.11,17.96 1.66,18.41 1.66,20.01 2.11,20.46 J2.B9 5.61,20.46 5.86,20.71 J2.A4 8.16,20.71 8.66,21.21 8.66,21.71 9.06,22.11 9.46,22.11 | C18.1 31.76,25.81 32.01,26.14 32.01,27.31 C5.1 30.56,28.76 30.56,30.01 30.16,30.41 29.36,30.41 v28.66,29.71 | 12.01,22.11 12.01,22.31 12.01,23.56 v11.56,24.01
  Route2 0.254: v28.66,29.71 27.56,29.71 24.46,32.81 22.86,32.81 22.85,32.8 22.27,32.8 22.26,32.81 15.16,32.81 v14.86,33.11
  Bottom 0.254: v11.56,24.01 12.66,24.01 14.56,25.91 14.56,27.41 v14.66,27.51 13.56,28.61 13.56,31.81 v14.86,33.11
W_MFIO  (via drill 0.35)
  Top 0.254: MDBT1.60 14.29,7.14 v14.16,7.01
  Bottom 0.2: J3.12 19.46,6.61 18.46,7.61 17.96,7.61 17.56,7.21 17.56,6.61 17.16,6.21 16.36,6.21 15.46,7.11 14.26,7.11 v14.16,7.01

### Text on the board
tPlace: protocentral.com | 3V3 | B+ | B- | TX | GND | P19 | P21 | RST | GND | 04/24 | v4
bPlace: pc_healthypi_move | SW2 / SEL | FLS / SUP | 1.8V | PPC | MUX_SEL | EN | MC | 3V3 | DIS | SW1_SEL | PPC | v4 | MC | 04/24 | protocentral.com
tNames: U3